# EasyEDA Pro project ProProject_new1_2024-06-04.epro

# Schematic New1_3
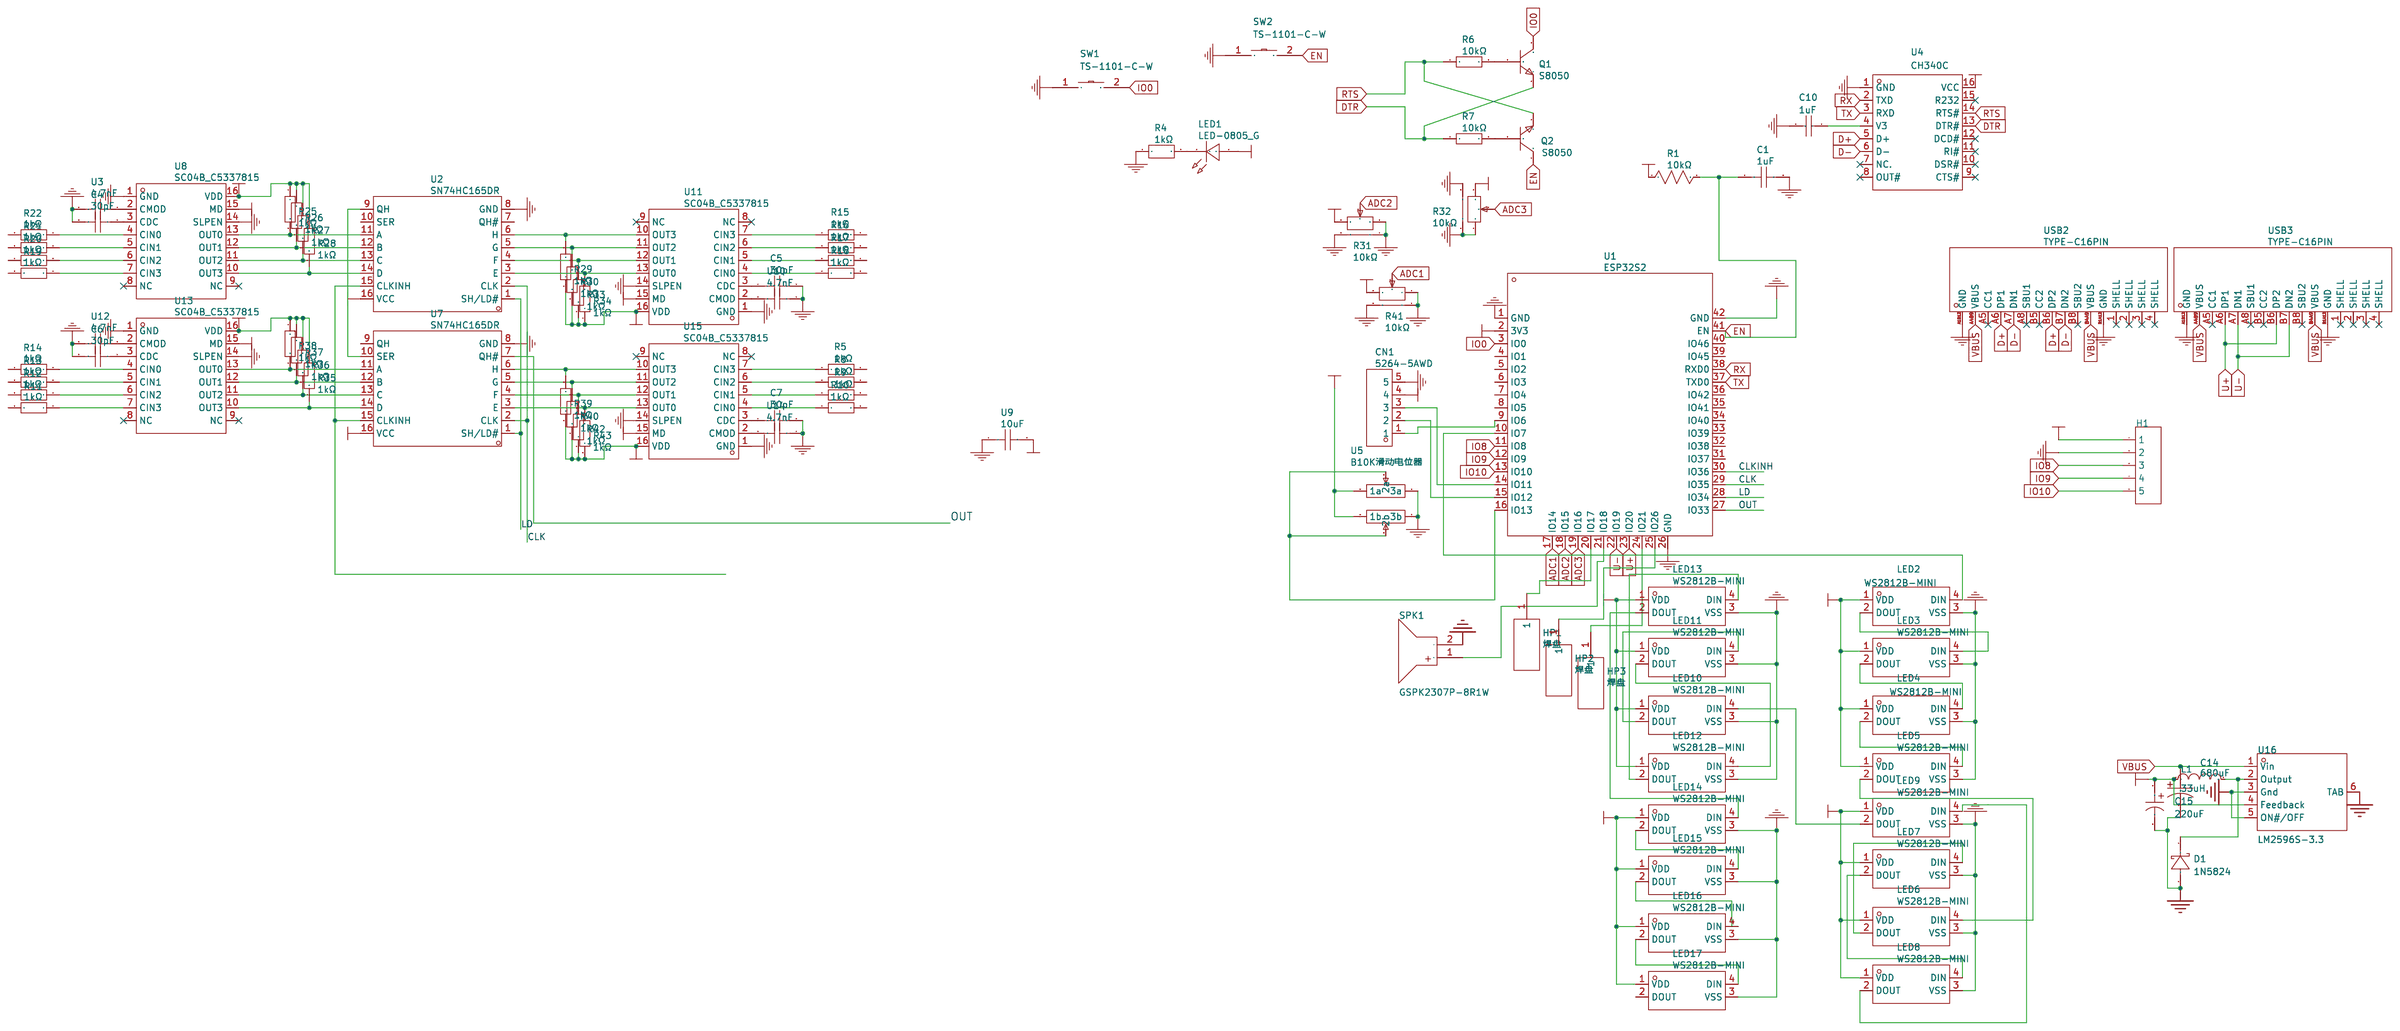
[diagram p0: schematic sheet]

## Parts
C1  1uF  [C0603]
C4  30pF  [C0603]
C5  30pF  [C0603]
C6  30pF  [C0603]
C7  30pF  [C0603]
C10  1uF  [C0805]
C14  680uF  [CAP-TH_BD6.3-P2.50-D1.0-FD]
C15  220uF  [CAP-TH_BD8.0-P3.50-D0.6-FD-2]
CN1  5264-5AWD  [CONN-TH_5P-P2.50_5264-5AWD]
D1  1N5824  [DO-27_BD5.3-L8.4-P12.40-D1.3-RD]
H1  -  [HDR-TH_5P-P2.54-V-F]
HP1  焊盘  [焊盘]
HP2  焊盘  [焊盘]
HP3  焊盘  [焊盘]
L1  33uH  [IND-SMD_L7.0-W6.6_FXL0630]
LED1  LED-0805_G  [LED0805_GREEN]
LED2  WS2812B-MINI  [LED-SMD_4P-L3.5-W3.5-TL_WS2812B]
LED3  WS2812B-MINI  [LED-SMD_4P-L3.5-W3.5-TL_WS2812B]
LED4  WS2812B-MINI  [LED-SMD_4P-L3.5-W3.5-TL_WS2812B]
LED5  WS2812B-MINI  [LED-SMD_4P-L3.5-W3.5-TL_WS2812B]
LED6  WS2812B-MINI  [LED-SMD_4P-L3.5-W3.5-TL_WS2812B]
LED7  WS2812B-MINI  [LED-SMD_4P-L3.5-W3.5-TL_WS2812B]
LED8  WS2812B-MINI  [LED-SMD_4P-L3.5-W3.5-TL_WS2812B]
LED9  WS2812B-MINI  [LED-SMD_4P-L3.5-W3.5-TL_WS2812B]
LED10  WS2812B-MINI  [LED-SMD_4P-L3.5-W3.5-TL_WS2812B]
LED11  WS2812B-MINI  [LED-SMD_4P-L3.5-W3.5-TL_WS2812B]
LED12  WS2812B-MINI  [LED-SMD_4P-L3.5-W3.5-TL_WS2812B]
LED13  WS2812B-MINI  [LED-SMD_4P-L3.5-W3.5-TL_WS2812B]
LED14  WS2812B-MINI  [LED-SMD_4P-L3.5-W3.5-TL_WS2812B]
LED15  WS2812B-MINI  [LED-SMD_4P-L3.5-W3.5-TL_WS2812B]
LED16  WS2812B-MINI  [LED-SMD_4P-L3.5-W3.5-TL_WS2812B]
LED17  WS2812B-MINI  [LED-SMD_4P-L3.5-W3.5-TL_WS2812B]
Q1  S8050  [SOT-23-3_L2.9-W1.3-P1.90-LS2.4-BR]
Q2  S8050  [SOT-23-3_L2.9-W1.3-P1.90-LS2.4-BR]
R1  10kΩ  [R0603]
R4  1kΩ  [R0805]
R5  1kΩ  [R0603]
R6  10kΩ  [R0805]
R7  10kΩ  [R0805]
R8  1kΩ  [R0603]
R9  1kΩ  [R0603]
R10  1kΩ  [R0603]
R11  1kΩ  [R0603]
R12  1kΩ  [R0603]
R13  1kΩ  [R0603]
R14  1kΩ  [R0603]
R15  1kΩ  [R0603]
R16  1kΩ  [R0603]
R17  1kΩ  [R0603]
R18  1kΩ  [R0603]
R19  1kΩ  [R0603]
R20  1kΩ  [R0603]
R21  1kΩ  [R0603]
R22  1kΩ  [R0603]
R25  1kΩ  [R0603]
R26  1kΩ  [R0603]
R27  1kΩ  [R0603]
R28  1kΩ  [R0603]
R29  1kΩ  [R0603]
R30  1kΩ  [R0603]
R31  10kΩ  [RES-ADJ-TH_RK09K1130AJ3]
R32  10kΩ  [RES-ADJ-TH_RK09K1130AJ3]
R33  1kΩ  [R0603]
R34  1kΩ  [R0603]
R35  1kΩ  [R0603]
R36  1kΩ  [R0603]
R37  1kΩ  [R0603]
R38  1kΩ  [R0603]
R39  1kΩ  [R0603]
R40  1kΩ  [R0603]
R41  10kΩ  [RES-ADJ-TH_RK09K1130AJ3]
R42  1kΩ  [R0603]
R43  1kΩ  [R0603]
SPK1  GSPK2307P-8R1W  [SPK-TH_BD23.0-P10.00-D0.8-L-RD]
SW1  TS-1101-C-W  [SW-SMD_L6.0-W3.3-LS8.0]
SW2  TS-1101-C-W  [SW-SMD_L6.0-W3.3-LS8.0]
U1  ESP32S2  [ESP32S2]
U2  SN74HC165DR  [SOP-16_L10.0-W3.9-P1.27-LS6.0-BL]
U3  4.7nF  [C0603]
U4  CH340C  [SOP-16_L10.0-W3.9-P1.27-LS6.0-BL]
U5  B10K滑动电位器  [B10K]
U7  SN74HC165DR  [SOP-16_L10.0-W3.9-P1.27-LS6.0-BL]
U8  SC04B_C5337815  [SOP-16_L10.0-W3.9-P1.27-LS6.0-BL]
U9  10uF  [C1206]
U10  4.7nF  [C0603]
U11  SC04B_C5337815  [SOP-16_L10.0-W3.9-P1.27-LS6.0-BL]
U12  4.7nF  [C0603]
U13  SC04B_C5337815  [SOP-16_L10.0-W3.9-P1.27-LS6.0-BL]
U14  4.7nF  [C0603]
U15  SC04B_C5337815  [SOP-16_L10.0-W3.9-P1.27-LS6.0-BL]
U16  LM2596S-3.3  [TO-263-5_L10.0-W8.4-P1.70-LS15.3-BR]
USB2  TYPE-C16PIN  [USB-C-SMD_TYPE-C16PIN]
USB3  TYPE-C16PIN  [USB-C-SMD_TYPE-C16PIN]

## Library data of the parts
C1 = CL10A105KB8NNNC: 容值:1uF;精度:±10%;额定电压:50V;材质(温度系数):X5R;; LCSC Part Name: 1uF ±10% 50V; Supplier Part: C15849; Manufacturer: SAMSUNG(三星); Supplier Footprint: 0603; JLCPCB Part Class: Basic Part; Datasheet: https://atta.szlcsc.com/upload/public/pdf/source/20160218/1457707763339.pdf; Supplier: LCSC; Tolerance: ±10%; Voltage Rated: 50V; Temperature Coefficient: X5R
C4-C7 = 30pF: Supplier: LCSC; Supplier Part: C376782; Manufacturer: CCTC(三环); Manufacturer Part: TCC0603COG300J500CT; JLCPCB Part Class: Extended Part
C10 = 1uF: Supplier: LCSC; Manufacturer: muRata(村田); Manufacturer Part: GRM21BR61E226ME44L; Supplier Part: C86816; JLCPCB Part Class: Extended Part
C14 = SHW680UF10V6.3X11: 容值:680uF;精度:±20%;额定电压:10V;纹波电流:980mA@100kHz;等效串联电阻:50mΩ@300kHz;; LCSC Part Name: 680uF ±20% 10V; Supplier Part: C494547; Manufacturer: KNSCHA(科尼盛); Supplier Footprint: 插件,D6.3xL11mm; JLCPCB Part Class: 扩展库; Datasheet: https://atta.szlcsc.com/upload/public/pdf/source/20200310/C494548_8AB2F4B606EB8D11D75E4665E4154421.pdf; Supplier: LCSC; Tolerance: ±20%; Rated Voltage: 10V; Ripple Current: 980mA@100kHz; Equivalent Series Resistance(ESR): 50mΩ@300kHz; Lead Spacing: 2.5mm; φD: 6.3mm; L: 11mm; Lifetime @ Temp: 10000hrs@105℃
C15 = KNH2220UF35V149EC0049: 容值:220uF;精度:±20%;额定电压:35V;纹波电流:1.7A@100kHz;等效串联电阻:40mΩ@100kHz;; LCSC Part Name: 220uF ±20% 35V; Supplier Part: C2981462; Manufacturer: KNSCHA(科尼盛); Supplier Footprint: 插件,D8xL9mm; JLCPCB Part Class: 扩展库; Datasheet: https://atta.szlcsc.com/upload/public/pdf/source/20220426/9FC8A158D93B909CC105160B4A0CB698.pdf; Supplier: LCSC; Tolerance: ±20%; Rated Voltage: 35V; Ripple Current: 1.7A@100kHz; Equivalent Series Resistance(ESR): 40mΩ@100kHz; Lead Spacing: 3.5mm; φD: 8mm; L: 9mm; Lifetime @ Temp: 2000hrs@105℃; Operating Temperature: -55℃~+105℃
CN1 = 5264-5AWD: Supplier: LCSC; Manufacturer: BOOMELE(博穆精密); Manufacturer Part: 5264-5AWD米色; Supplier Part: C176652; JLCPCB Part Class: Extended Part
D1 = 1N5824_C7503125: 二极管配置:独立式;正向压降(Vf):550mV@5A;直流反向耐压(Vr):30V;平均整流电流(Io):5A;; LCSC Part Name: 电压:30V 电流:5A; Supplier Part: C7503125; Manufacturer: FUXINSEMI(富芯森美); Supplier Footprint: DO-201AD; JLCPCB Part Class: 扩展库; Datasheet: https://atta.szlcsc.com/upload/public/pdf/source/20230904/20F3394C6D1B7A17743713246CA97DB3.pdf; Supplier: LCSC; Diode Configuration: 独立式; Forward Voltage (Vf@If): 550mV@5A; Reverse Voltage (Vr): 30V; Average Rectified Current (Io): 5A; Reverse Leakage Current (Ir): 500uA@30V; Peak forward surge current: 150A
H1 = HDR-F_2.54_1x5P: Supplier Part: C50950; Supplier Footprint: 插件
HP1-HP3 = 焊盘: Manufacturer: .....; Manufacturer Part: .....; Supplier Part: .....; link: .....; Check: false
L1 = FXL0630-330-M: 电感值:33uH;精度:±20%;额定电流:2A;饱和电流(Isat):2.5A;类型:一体成型电感;; LCSC Part Name: 33uH ±20% 2.5A; Supplier Part: C177245; Manufacturer: cjiang(长江微电); Supplier Footprint: SMD,6.6x7mm; JLCPCB Part Class: 扩展库; Datasheet: https://atta.szlcsc.com/upload/public/pdf/source/20230516/3A080F5AF8C87BB81C3BA86E5F60E51A.pdf; Supplier: LCSC; Tolerance: ±20%; Rated Current: 2A; Saturation Current (Isat): 2.5A; DC Resistance (DCR): 310mΩ; Type: 一体成型电感
LED1 = LED-0805_G: Manufacturer: 国星光电; Manufacturer Part: NCD0805G1; Supplier Part: C84260
LED2-LED17 = WS2812B-MINI: Supplier: LCSC; Supplier Part: C527089; Manufacturer: worldsemi; Manufacturer Part: WS2812B-MINI-V3/W; JLCPCB Part Class: Extended Part
Q1 Q2 = S8050: Supplier: LCSC; Manufacturer: Yenji; Supplier Part: C139514; JLCPCB Part Class: Extend
R1 = 0603WAF1002T5E: 电阻类型:厚膜电阻;阻值:10kΩ;精度:±1%;功率:100mW;最大工作电压:75V;温度系数:±100ppm/℃;; LCSC Part Name: 厚膜电阻 10kΩ ±1% 100mW; Supplier Part: C25804; Manufacturer: UNI-ROYAL(厚声); Supplier Footprint: 0603; JLCPCB Part Class: Basic Part; Datasheet: https://atta.szlcsc.com/upload/public/pdf/source/20200306/C422600_1E6D84923E4A46A82E41ADD87F860B5C.pdf; Supplier: LCSC; Type: 厚膜电阻; Tolerance: ±1%; Power(Watts): 100mW; Overload Voltage (Max): 75V; Temperature Coefficient: ±100ppm/℃; Operating Temperature Range: -55℃~+155℃
R4 = 1kΩ: Supplier: LCSC; Supplier Part: C2767302; Manufacturer: UNI-ROYAL(厚声); Manufacturer Part: 0805W8D1001T5E; JLCPCB Part Class: Extended Part
R5 R8-R22 R25-R30 R33-R40 R42 R43 = 1kΩ: Supplier: LCSC; Supplier Part: C336844; Manufacturer: PANASONIC(松下); Manufacturer Part: ERJ3RBD1001V; JLCPCB Part Class: Extended Part
R6 R7 = 10kΩ: Supplier: LCSC; Manufacturer: UNI-ROYAL(厚声); Manufacturer Part: 0805W8F1002T5E; Supplier Part: C17414; JLCPCB Part Class: Basic Part
R31 R32 R41 = 10kΩ: Supplier: LCSC; Supplier Part: C470295; Manufacturer: ALPSALPINE(阿尔卑斯阿尔派); Manufacturer Part: RK09K1130AP5; JLCPCB Part Class: Extended Part
SPK1 = GSPK2307P-8R1W: Supplier Part: C530531; Manufacturer: INGHAi(赢海); JLCPCB Part Class: 扩展库; Datasheet: https://atta.szlcsc.com/upload/public/pdf/source/20200723/C530531_BBB4236C037415C04A54E89A31B50803.pdf; Supplier: LCSC
SW1 SW2 = TS-1101-C-W: Supplier: LCSC; Supplier Part: C318938; Manufacturer: XKB Connectivity(中国星坤); JLCPCB Part Class: Extended Part
U1 = ESP32S2: Supplier: LCSC; Supplier Part: C2973654; Manufacturer: ESPRESSIF(乐鑫); Manufacturer Part: ESP32-S2-WROVER-I-N8R2
U2 U7 = SN74HC165DR: Supplier Part: C61060; Supplier: LCSC; Manufacturer: TI(德州仪器); JLCPCB Part Class: Extended Part
U3 U10 U12 U14 = 4.7nF: Supplier: LCSC; Supplier Part: C3894321; Manufacturer: TDK; Manufacturer Part: C1608JB2A472M080AA; JLCPCB Part Class: Extended Part
U4 = CH340C: Supplier Part: C84681; Supplier: LCSC; Manufacturer: WCH(南京沁恒); JLCPCB Part Class: Extended Part
U5 = B10K滑动电位器: Check: false
U8 U11 U13 U15 = SC04B_C5337815: Supplier Part: C5337815; Supplier: LCSC; Manufacturer: icman(晶尊微); Manufacturer Part: SC04B; JLCPCB Part Class: Extended Part
U9 = 10uF: Supplier: LCSC; Supplier Part: C2918487; Manufacturer: SAMWHA(三和); Manufacturer Part: CS3216Y5V106Z350NRI; JLCPCB Part Class: Extended Part
U16 = LM2596S-3.3: 功能类型:降压型;输出类型:固定;输入电压:40V;输出电压:3.3V;输出电流(最大值):3A;; Supplier Part: C347420; Manufacturer: UMW(友台半导体); Supplier Footprint: TO-263-5; JLCPCB Part Class: 扩展库; Datasheet: https://atta.szlcsc.com/upload/public/pdf/source/20230506/0930E65C3A8B7B120C8A4D8E5A8AC327.pdf; Supplier: LCSC; Function: 降压型; Output Type: 固定; Input Voltage: 40V; Output Voltage: 3.3V; Output Current (Max): 3A; Switching Frequency: 150kHz; Operating Temperature: -40℃~+125℃@(TA); Synchronous Rectification: 否; Number of Outputs: 1; Topology: 降压式; Switch tube (built-in/external): 内置
USB2 USB3 = TYPE-C16PIN: Supplier: LCSC; Supplier Part: C393939; Manufacturer: SHOU HAN(首韩); JLCPCB Part Class: Extended Part

## Nets
GND: C1.2 C4.2 C5.2 C6.2 C7.2 C10.2 C14.2 C15.2 CN1.5 D1.2(A) H1.2 LED2.3(VSS) LED3.3(VSS) LED4.3(VSS) LED5.3(VSS) LED6.3(VSS) LED7.3(VSS) LED8.3(VSS) LED9.3(VSS) LED10.3(VSS) LED11.3(VSS) LED12.3(VSS) LED13.3(VSS) LED14.3(VSS) LED15.3(VSS) LED16.3(VSS) LED17.3(VSS) R4.1 R31.1 R31.4 R31.5 R32.1 R32.4 R32.5 R41.1 R41.4 R41.5 SPK1.2(-) SW1.1 SW2.1 U1.1(GND) U1.26(GND) U1.42(GND) U2.8(GND) U3.1 U4.1(GND) U5.3a U5.3b U7.8(GND) U8.1(GND) U8.14(SLPEN) U9.1 U10.1 U11.1(GND) U11.14(SLPEN) U12.1 U13.1(GND) U13.14(SLPEN) U14.1 U15.1(GND) U15.14(SLPEN) U16.3(Gnd) U16.5(ON#/OFF) U16.6(TAB) USB2.A1B12(GND) USB2.B1A12(GND) USB3.A1B12(GND) USB3.B1A12(GND)
VBUS: C14.1 U16.1(Vin) USB2.A4B9(VBUS) USB2.B4A9(VBUS) USB3.A4B9(VBUS) USB3.B4A9(VBUS)
VCC: C15.1 CN1.4 H1.1 L1.1 LED1.1 LED2.1(VDD) LED3.1(VDD) LED4.1(VDD) LED5.1(VDD) LED6.1(VDD) LED7.1(VDD) LED8.1(VDD) LED9.1(VDD) LED10.1(VDD) LED11.1(VDD) LED12.1(VDD) LED13.1(VDD) LED14.1(VDD) LED15.1(VDD) LED16.1(VDD) LED17.1(VDD) R1.1 R25.1 R26.1 R27.1 R28.1 R29.1 R30.1 R31.3 R32.3 R33.1 R34.1 R35.1 R36.1 R37.1 R38.1 R39.1 R40.1 R41.3 R42.1 R43.1 U1.2(3V3) U2.16(VCC) U4.16(VCC) U5.1a U5.1b U7.16(VCC) U8.15(MD) U8.16(VDD) U9.2 U11.15(MD) U11.16(VDD) U13.15(MD) U13.16(VDD) U15.15(MD) U15.16(VDD) U16.4(Feedback)
ADC1: R41.2 U1.17(IO14)
ADC2: R31.2 U1.18(IO15)
ADC3: R32.2 U1.19(IO16)
CLK: U1.29(IO35) U2.2(CLK) U7.2(CLK)
CLKINH: U1.30(IO36)
D+: U4.5(D+) USB2.A6(DP1) USB2.B6(DP2)
D-: U4.6(D-) USB2.A7(DN1) USB2.B7(DN2)
DTR: Q1.2(E) R7.1 U4.13(DTR#)
EN: C1.1 Q2.3(C) R1.2 SW2.2 U1.41(EN)
IO0: Q1.3(C) SW1.2 U1.3(IO0)
IO8: H1.3 U1.11(IO8)
IO9: H1.4 U1.12(IO9)
IO10: H1.5 U1.13(IO10)
LD: U1.28(IO34) U2.1(SH/LD#) U7.1(SH/LD#)
OUT: U1.27(IO33) U7.7(QH#)
RTS: Q2.2(E) R6.1 U4.14(RTS#)
RX: U1.38(RXD0) U4.2(TXD)
TX: U1.37(TXD0) U4.3(RXD)
U+: U1.23(IO20) USB3.A6(DP1) USB3.B6(DP2)
U-: U1.22(IO19) USB3.A7(DN1) USB3.B7(DN2)
$1N3: C10.1 U4.4(V3)
$1N11: LED4.2(DOUT) LED5.4(DIN)
$1N12: LED2.2(DOUT) LED3.4(DIN)
$1N29: LED5.2(DOUT) LED6.4(DIN)
$1N30: LED7.2(DOUT) LED8.4(DIN)
$1N31: LED6.2(DOUT) LED7.4(DIN)
$1N32: LED8.2(DOUT) LED9.4(DIN)
$1N33: LED9.2(DOUT) LED10.4(DIN)
$1N34: LED10.2(DOUT) LED11.4(DIN)
$1N35: LED11.2(DOUT) LED12.4(DIN)
$1N36: LED12.2(DOUT) LED13.4(DIN)
$1N46: LED3.2(DOUT) LED4.4(DIN)
$1N47: LED2.4(DIN) U1.10(IO7)
$1N48: LED13.2(DOUT) LED14.4(DIN)
$1N49: LED14.2(DOUT) LED15.4(DIN)
$1N50: LED15.2(DOUT) LED16.4(DIN)
$1N51: LED16.2(DOUT) LED17.4(DIN)
$1N61: CN1.1 U1.9(IO6)
$1N66: R25.2 U2.11(A) U8.13(OUT0)
$1N67: R26.2 U2.12(B) U8.12(OUT1)
$1N68: R27.2 U2.13(C) U8.11(OUT2)
$1N69: R28.2 U2.14(D) U8.10(OUT3)
$1N71: R22.1 U8.4(CIN0)
$1N72: R21.1 U8.5(CIN1)
$1N73: R20.1 U8.6(CIN2)
$1N74: R19.1 U8.7(CIN3)
$1N75: R15.1 U11.7(CIN3)
$1N76: R16.1 U11.6(CIN2)
$1N77: R17.1 U11.5(CIN1)
$1N78: R18.1 U11.4(CIN0)
$1N79: R29.2 U2.6(H) U11.10(OUT3)
$1N81: R30.2 U2.5(G) U11.11(OUT2)
$1N82: R33.2 U2.4(F) U11.12(OUT1)
$1N85: R34.2 U2.3(E) U11.13(OUT0)
$1N90: R11.1 U13.7(CIN3)
$1N91: R12.1 U13.6(CIN2)
$1N92: R13.1 U13.5(CIN1)
$1N93: R14.1 U13.4(CIN0)
$1N94: R35.2 U7.14(D) U13.10(OUT3)
$1N96: R36.2 U7.13(C) U13.11(OUT2)
$1N97: R37.2 U7.12(B) U13.12(OUT1)
$1N100: R38.2 U7.11(A) U13.13(OUT0)
$1N102: R5.1 U15.7(CIN3)
$1N103: R8.1 U15.6(CIN2)
$1N104: R9.1 U15.5(CIN1)
$1N105: R10.1 U15.4(CIN0)
$1N106: R39.2 U7.6(H) U15.10(OUT3)
$1N108: R40.2 U7.5(G) U15.11(OUT2)
$1N109: R42.2 U7.4(F) U15.12(OUT1)
$1N112: R43.2 U7.3(E) U15.13(OUT0)
$1N114: U2.9(QH) U7.10(SER)
$1N2096: Q2.1(B) R7.2
$1N2099: Q1.1(B) R6.2
$1N2166: LED1.2 R4.2
$1N2213: C4.1 U8.3(CDC)
$1N2214: U3.2 U8.2(CMOD)
$1N2215: U10.2 U11.2(CMOD)
$1N2218: C5.1 U11.3(CDC)
$1N2223: U12.2 U13.2(CMOD)
$1N2226: C6.1 U13.3(CDC)
$1N2231: U14.2 U15.2(CMOD)
$1N2234: C7.1 U15.3(CDC)
$1N5140: D1.1(K) L1.2 U16.2(Output)
$1N5379: U2.15(CLKINH) U7.15(CLKINH)
$1N5430: CN1.3 U1.14(IO11)
$1N5439: CN1.2 U1.15(IO12)
$1N5456: U1.16(IO13) U5.2a U5.2b
$1N5500: HP1.1 U1.20(IO17)
$1N5779: HP3.1 U1.24(IO21)
$1N5793: HP2.1 U1.25(IO26)
$1N6036: SPK1.1(+) U1.21(IO18)

Not connected (* = marked no-connect by the designer): LED17 2(DOUT); R5 2; R8 2; R9 2; R10 2; R11 2; R12 2; R13 2; R14 2; R15 2; R16 2; R17 2; R18 2; R19 2; R20 2; R21 2; R22 2; U1 4(IO1) 5(IO2) 6(IO3) 7(IO4) 8(IO5) 31(IO37) 32(IO38) 33(IO39) 34(IO40) 35(IO41) 36(IO42) 39(IO45) 40(IO46); U2 7(QH#) 10(SER); U4 7(NC.)* 8(OUT#)* 9(CTS#)* 10(DSR#)* 11(RI#)* 12(DCD#)* 15(R232)*; U7 9(QH); U8 8(NC)* 9(NC)*; U11 8(NC)* 9(NC)*; U13 8(NC)* 9(NC)*; U15 8(NC)* 9(NC)*; USB2 1(SHELL)* 2(SHELL)* 3(SHELL)* 4(SHELL)* A5(CC1)* A8(SBU1)* B5(CC2)* B8(SBU2)*; USB3 1(SHELL)* 2(SHELL)* 3(SHELL)* 4(SHELL)* A5(CC1)* A8(SBU1)* B5(CC2)* B8(SBU2)*

# Board 1-PCB_PCB_New1_2
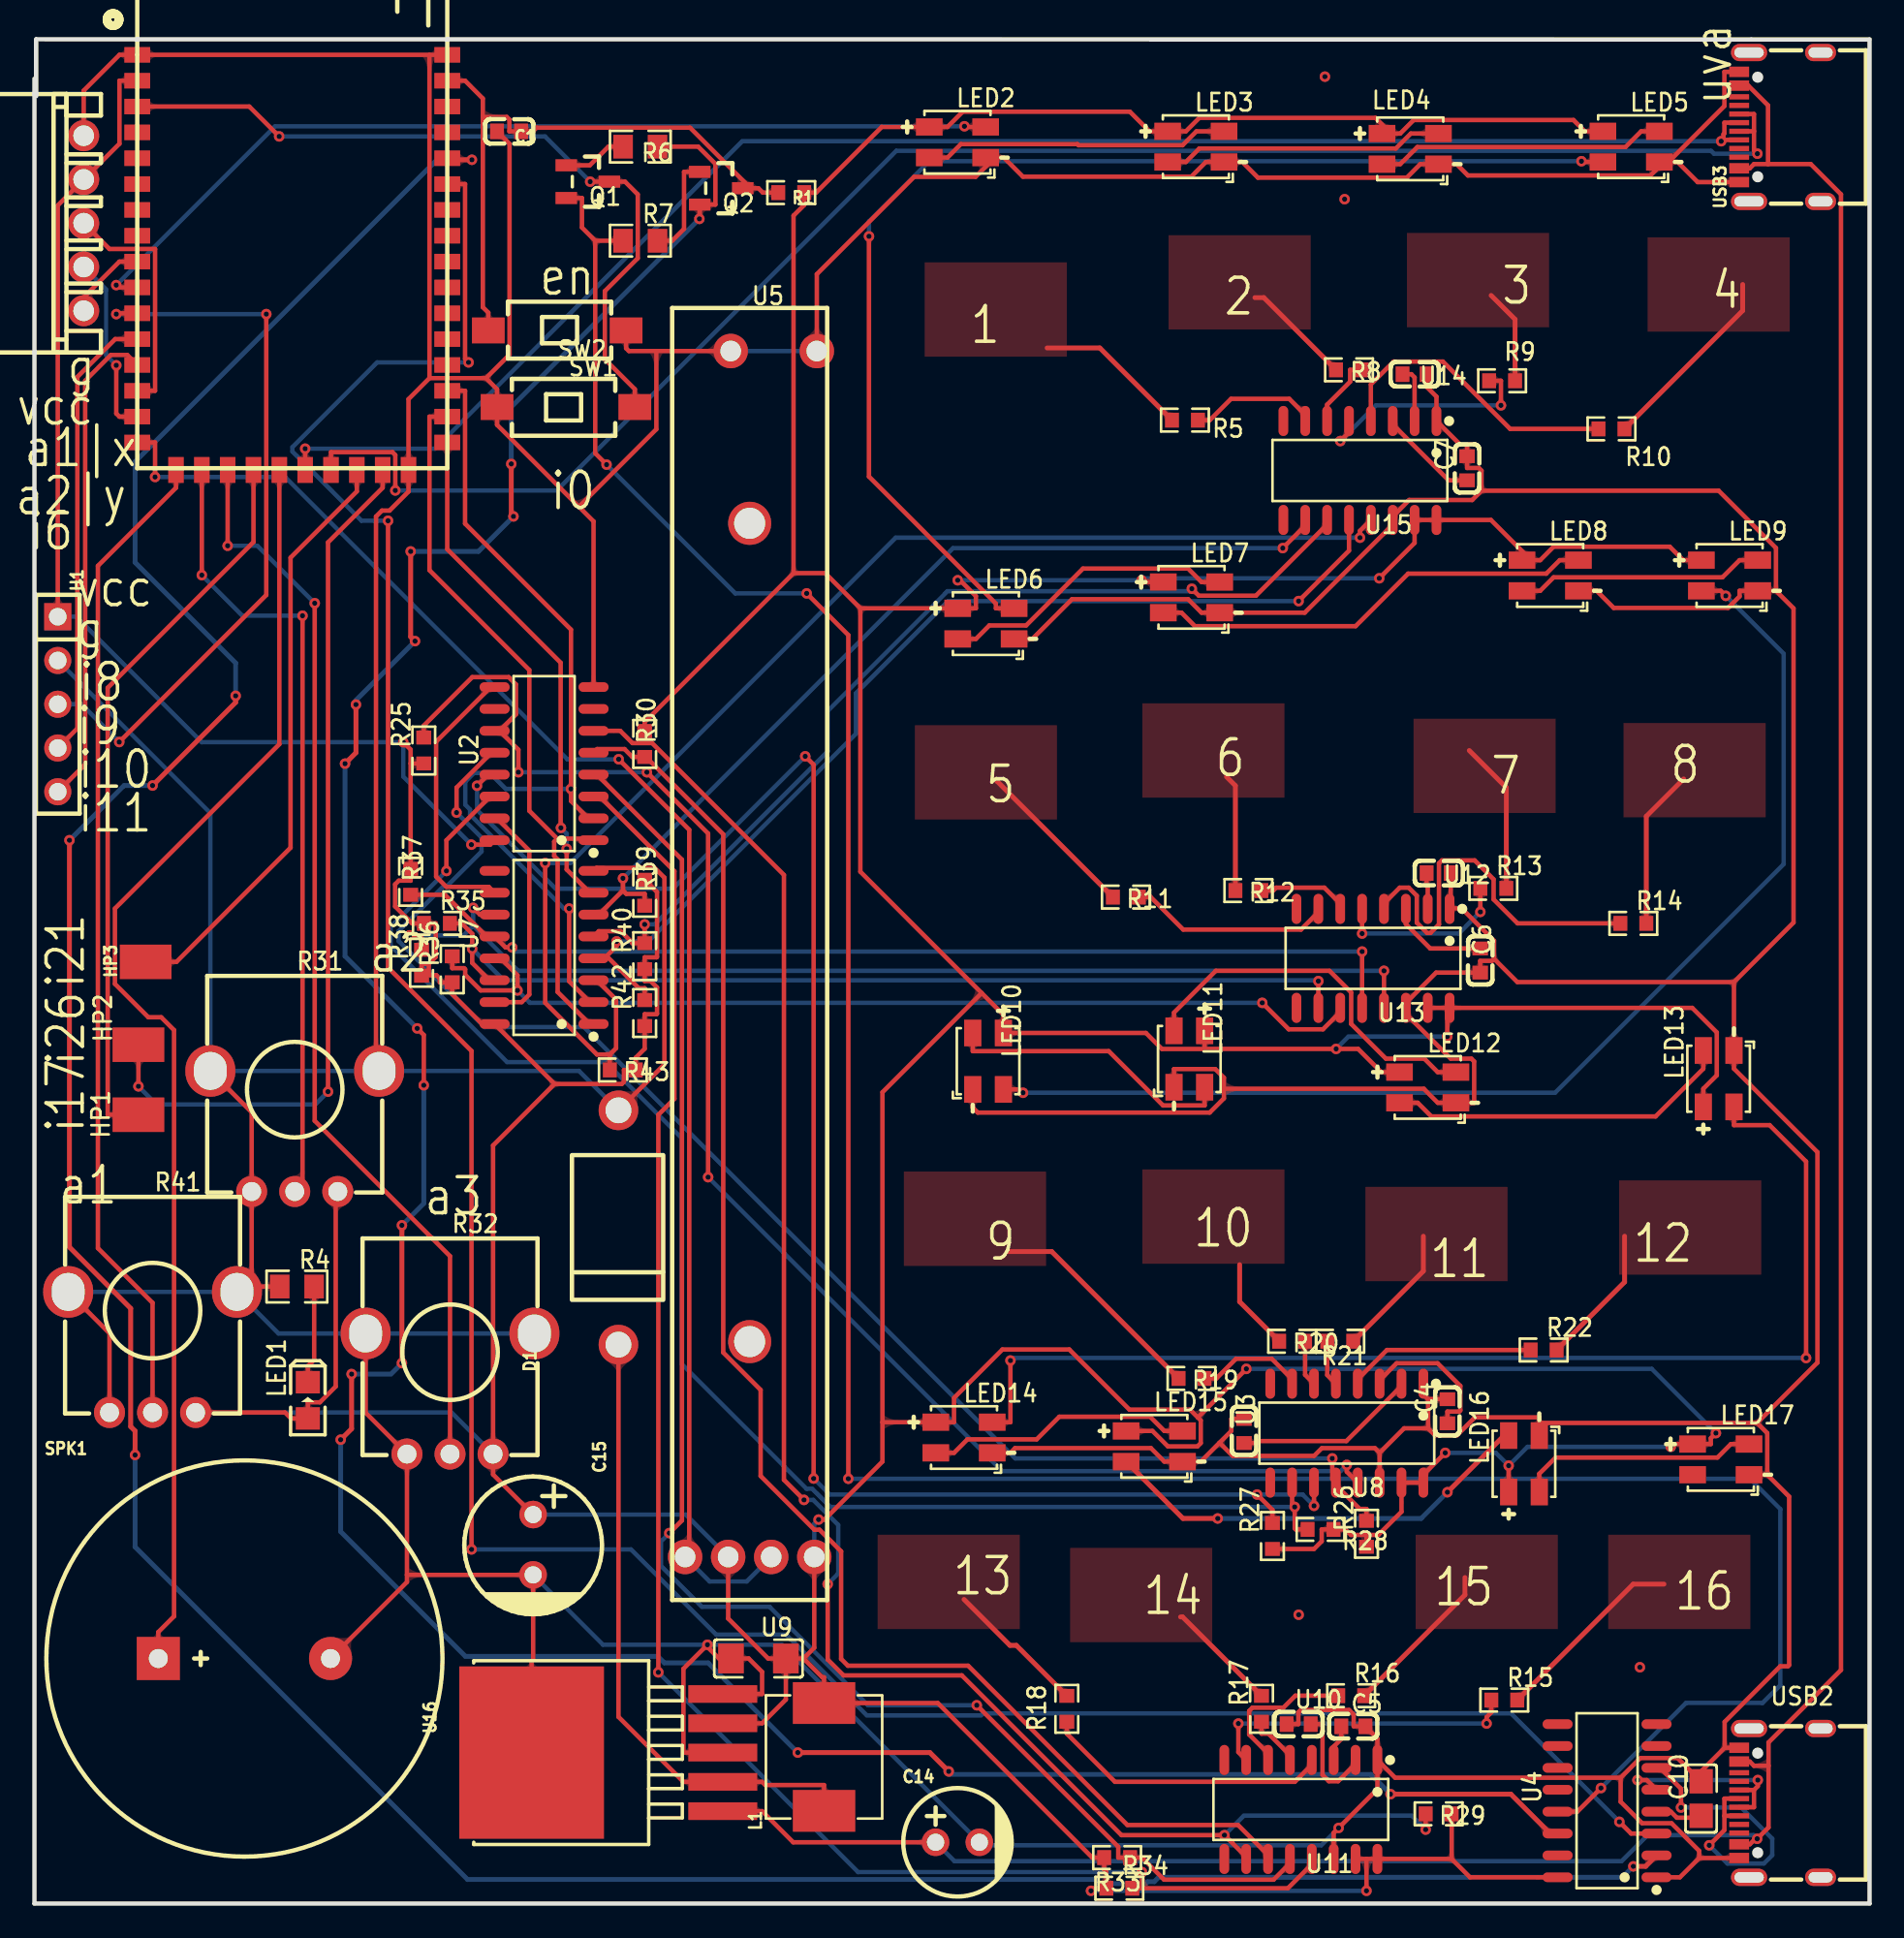
[diagram p1: board, top side]
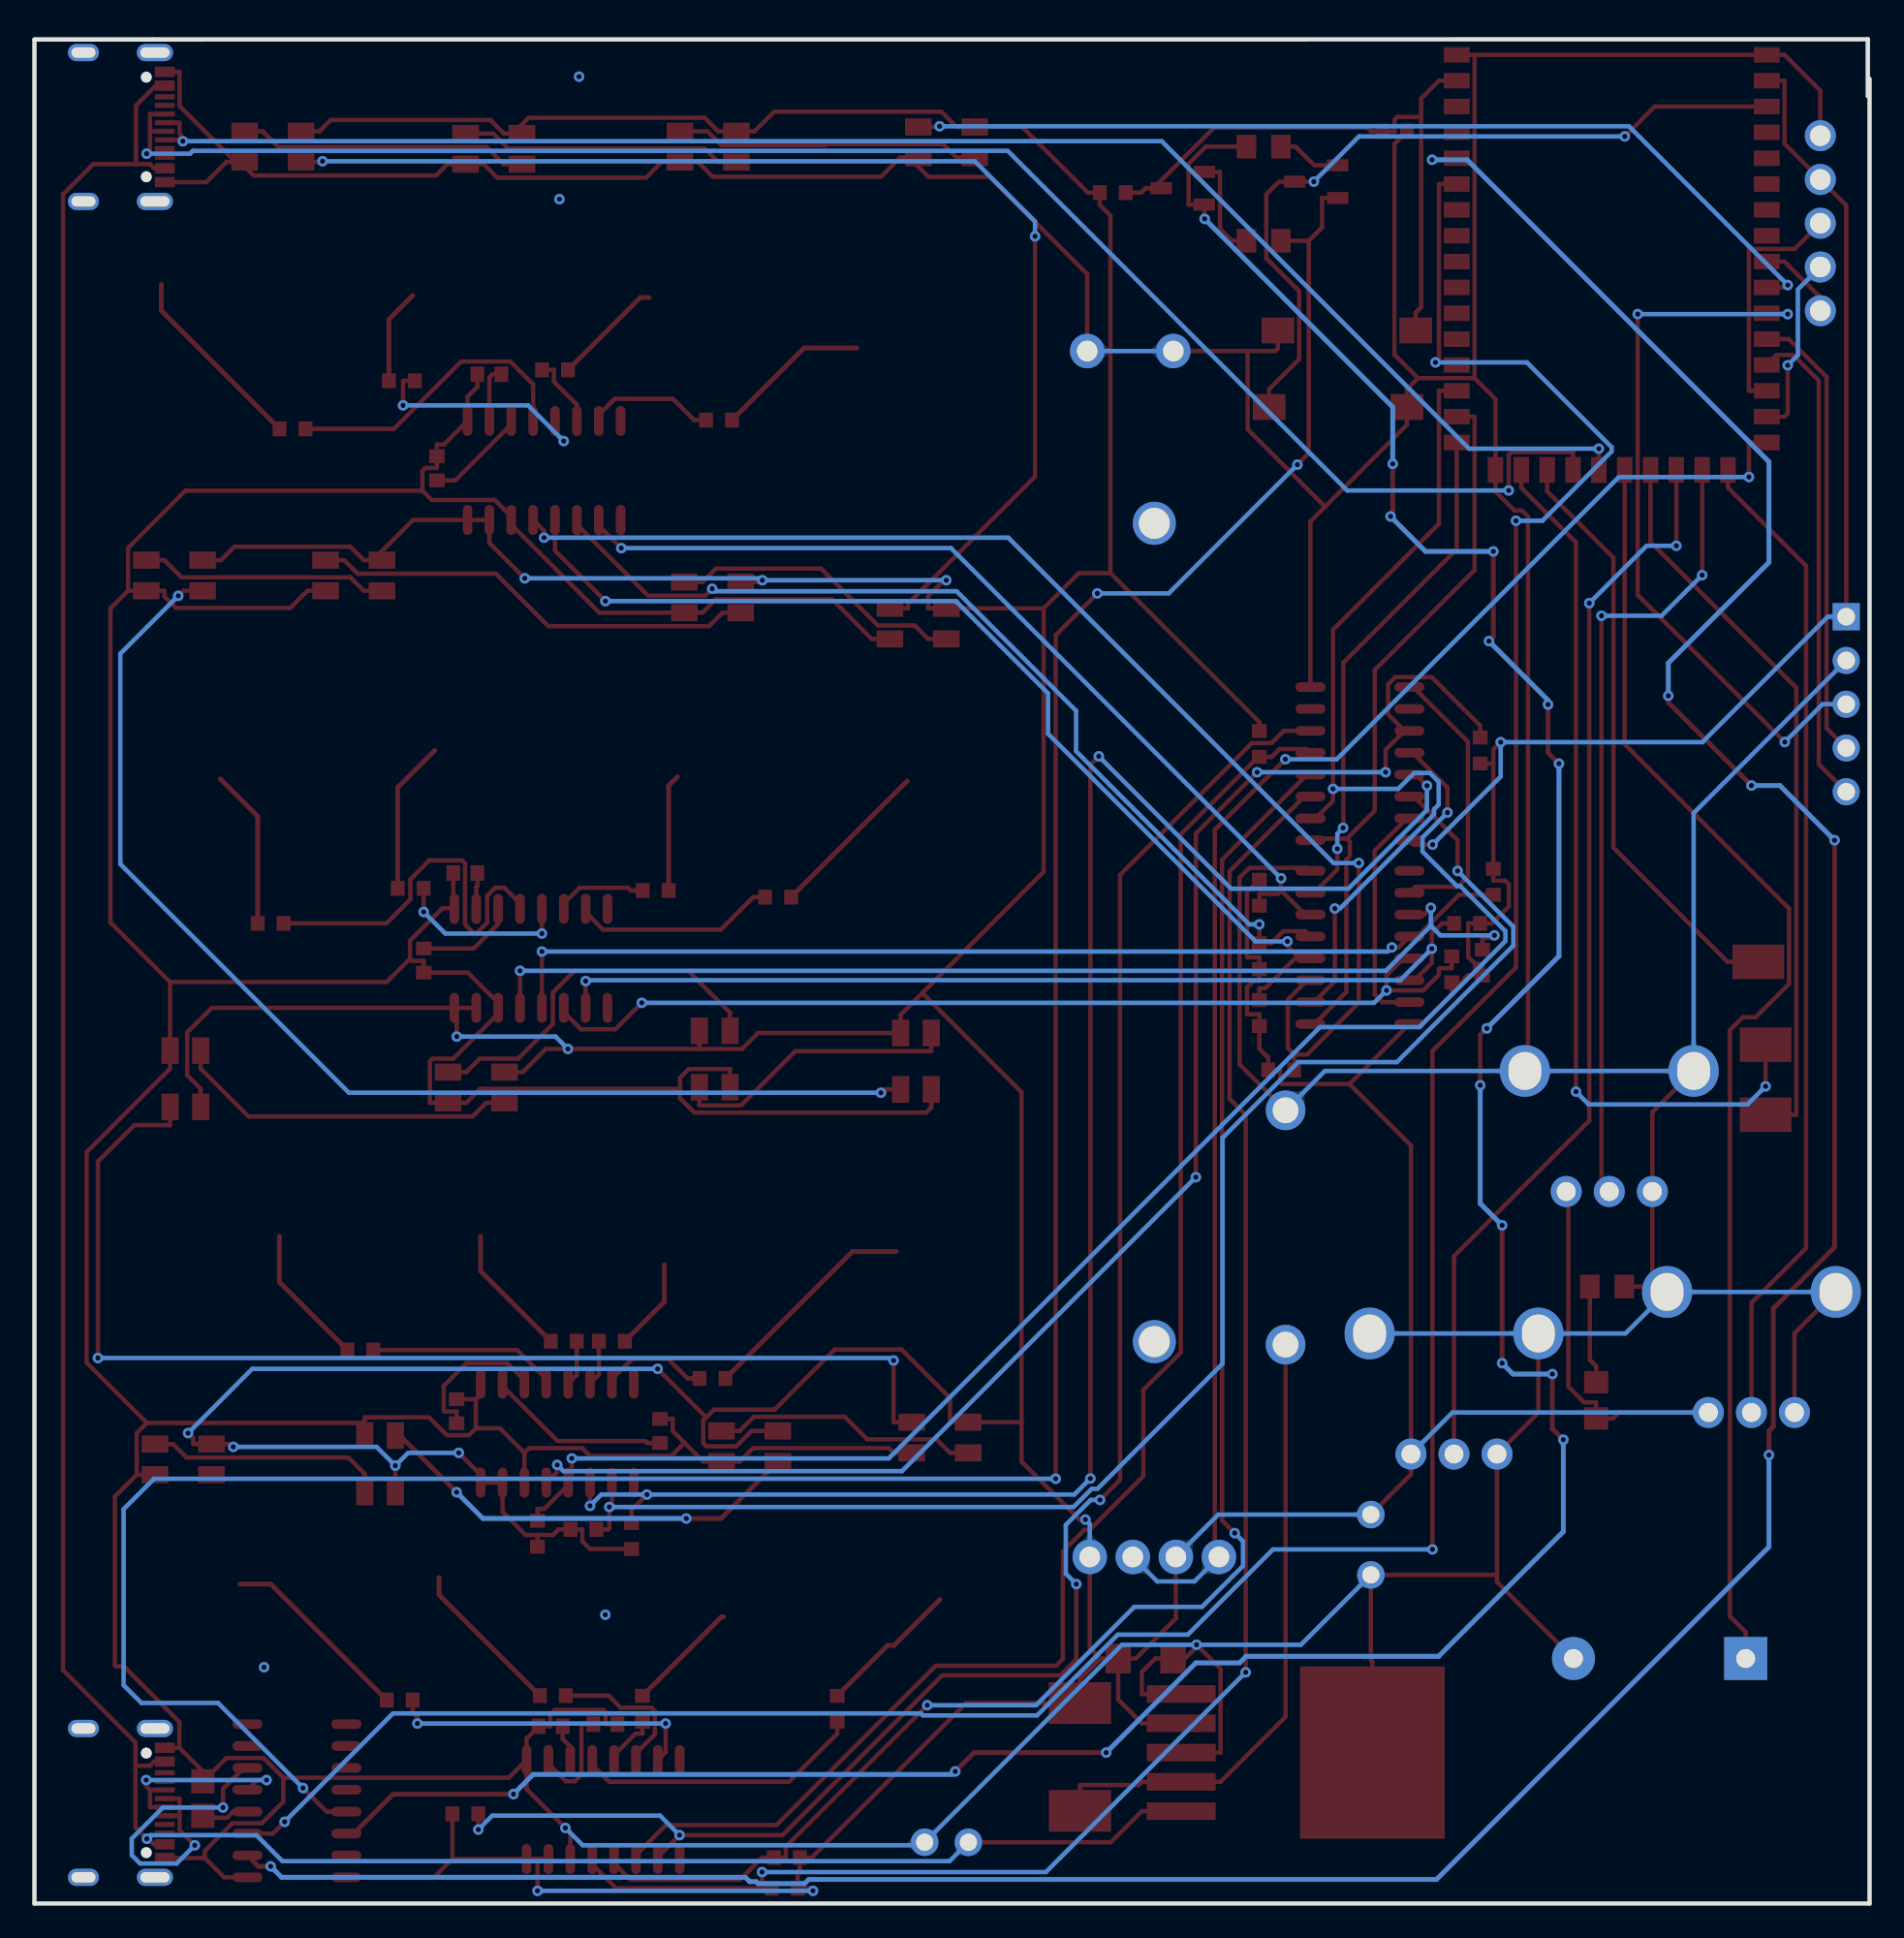
[diagram p2: board, bottom side, seen from below]

Outline 106.55 x 108.22 mm; copper layers: Top Layer, Bottom Layer. Coordinates in mm from the lower left corner of the outline.
Outline path: 0,105.92 0,0 106.55,0 106.55,108.2 99.67,108.2 0.1,108.22 0.1,104.91
Stack: Top Layer 0.035mm - / Dielectric1 1.51mm FR4 er 4.5 / Bottom Layer 0.035mm -

## Design rules (mm)
spacing Default (default): track to track 0.152, other pairs 0 to 0.152
track width Default (default): min 0.254, default 0.254, max 25.4
differential pair differentialPair (default): width min 0.127, default 0.254, max 2.54; gap min 0.152, default 0.152
via Default (default): diameter min 0.61, default 0.61, max 100.025; hole min 0.305, default 0.305, max 59.995
net GND uses gge1476470
pour e180 uses gge1476458

## Placement (name value [footprint] x y rotation side)
C1  1uF  [C0603]  27.56 102.87 180 top
C4  30pF  [C0603]  82.04 28.57 90 top
C5  30pF  [C0603]  76.58 10.29 0 top
C6  30pF  [C0603]  83.95 54.74 270 top
C7  30pF  [C0603]  83.19 83.31 90 top
C10  1uF  [C0805]  96.77 6.1 90 top
C14  680uF  [CAP-TH_BD6.3-P2.50-D1.0-FD]  53.59 3.56 0 top
C15  220uF  [CAP-TH_BD8.0-P3.50-D0.6-FD-2]  28.96 20.83 270 top
CN1  5264-5AWD  [CONN-TH_5P-P2.50_5264-5AWD]  2.16 97.54 90 top
D1  1N5824  [DO-27_BD5.3-L8.4-P12.40-D1.3-RD]  33.91 39.24 90 top
H1  -  [HDR-TH_5P-P2.54-V-F]  1.35 69.62 270 top
HP1  -  [焊盘]  6.04 45.79 90 top
HP2  -  [焊盘]  6.04 49.85 90 top
HP3  -  [焊盘]  6.46 54.66 90 top
L1  33uH  [IND-SMD_L7.0-W6.6_FXL0630]  45.85 8.51 90 top
LED1  LED-0805_G  [LED0805_GREEN]  15.88 29.21 90 top
LED2  WS2812B-MINI  [LED-SMD_4P-L3.5-W3.5-TL_WS2812B]  53.59 102.23 0 top
LED3  WS2812B-MINI  [LED-SMD_4P-L3.5-W3.5-TL_WS2812B]  67.44 101.98 0 top
LED4  WS2812B-MINI  [LED-SMD_4P-L3.5-W3.5-TL_WS2812B]  79.88 101.85 0 top
LED5  WS2812B-MINI  [LED-SMD_4P-L3.5-W3.5-TL_WS2812B]  92.71 101.98 0 top
LED6  WS2812B-MINI  [LED-SMD_4P-L3.5-W3.5-TL_WS2812B]  55.24 74.3 0 top
LED7  WS2812B-MINI  [LED-SMD_4P-L3.5-W3.5-TL_WS2812B]  67.18 75.82 0 top
LED8  WS2812B-MINI  [LED-SMD_4P-L3.5-W3.5-TL_WS2812B]  88.01 77.09 0 top
LED9  WS2812B-MINI  [LED-SMD_4P-L3.5-W3.5-TL_WS2812B]  98.42 77.09 0 top
LED10  WS2812B-MINI  [LED-SMD_4P-L3.5-W3.5-TL_WS2812B]  55.37 48.89 270 top
LED11  WS2812B-MINI  [LED-SMD_4P-L3.5-W3.5-TL_WS2812B]  67.06 49.02 270 top
LED12  WS2812B-MINI  [LED-SMD_4P-L3.5-W3.5-TL_WS2812B]  80.9 47.37 0 top
LED13  WS2812B-MINI  [LED-SMD_4P-L3.5-W3.5-TL_WS2812B]  97.79 47.88 90 top
LED14  WS2812B-MINI  [LED-SMD_4P-L3.5-W3.5-TL_WS2812B]  53.98 27.05 0 top
LED15  WS2812B-MINI  [LED-SMD_4P-L3.5-W3.5-TL_WS2812B]  65.02 26.54 0 top
LED16  WS2812B-MINI  [LED-SMD_4P-L3.5-W3.5-TL_WS2812B]  86.49 25.53 90 top
LED17  WS2812B-MINI  [LED-SMD_4P-L3.5-W3.5-TL_WS2812B]  97.92 25.78 0 top
Q1  S8050  [SOT-23-3_L2.9-W1.3-P1.90-LS2.4-BR]  32.13 99.95 180 top
Q2  S8050  [SOT-23-3_L2.9-W1.3-P1.90-LS2.4-BR]  39.88 99.57 180 top
R1  10kΩ  [R0603]  43.94 99.31 180 top
R4  1kΩ  [R0805]  15.24 35.81 0 top
R5  1kΩ  [R0603]  66.8 86.11 180 top
R6  10kΩ  [R0805]  35.18 101.98 180 top
R7  10kΩ  [R0805]  35.18 96.52 0 top
R8  1kΩ  [R0603]  76.33 89.03 180 top
R9  1kΩ  [R0603]  85.22 88.39 0 top
R10  1kΩ  [R0603]  91.57 85.6 0 top
R11  1kΩ  [R0603]  63.37 58.42 180 top
R12  1kΩ  [R0603]  70.48 58.8 180 top
R13  1kΩ  [R0603]  84.71 58.93 0 top
R14  1kΩ  [R0603]  92.84 56.9 0 top
R15  1kΩ  [R0603]  85.34 11.81 0 top
R16  1kΩ  [R0603]  76.45 12.06 0 top
R17  1kΩ  [R0603]  71.25 11.3 90 top
R18  1kΩ  [R0603]  59.94 11.3 90 top
R19  1kΩ  [R0603]  67.18 30.48 180 top
R20  1kΩ  [R0603]  73.02 32.64 180 top
R21  1kΩ  [R0603]  75.82 32.64 0 top
R22  1kΩ  [R0603]  87.63 32.13 0 top
R25  1kΩ  [R0603]  22.61 66.93 90 top
R26  1kΩ  [R0603]  77.34 21.46 90 top
R27  1kΩ  [R0603]  71.88 21.34 90 top
R28  1kΩ  [R0603]  74.68 21.72 180 top
R29  1kΩ  [R0603]  81.53 5.21 180 top
R30  1kΩ  [R0603]  35.43 67.31 270 top
R31  10kΩ  [RES-ADJ-TH_RK09K1130AJ3]  15.11 44.83 0 top
R32  10kΩ  [RES-ADJ-TH_RK09K1130AJ3]  24.13 29.59 0 top
R33  1kΩ  [R0603]  62.86 2.67 0 top
R34  1kΩ  [R0603]  62.99 0.89 0 top
R35  1kΩ  [R0603]  23.37 56.9 0 top
R36  1kΩ  [R0603]  24.26 54.23 90 top
R37  1kΩ  [R0603]  21.84 59.31 270 top
R38  1kΩ  [R0603]  22.48 54.61 90 top
R39  1kΩ  [R0603]  35.43 58.67 270 top
R40  1kΩ  [R0603]  35.43 54.99 90 top
R41  10kΩ  [RES-ADJ-TH_RK09K1130AJ3]  6.86 32 0 top
R42  1kΩ  [R0603]  35.43 51.69 90 top
R43  1kΩ  [R0603]  34.16 48.39 180 top
SPK1  GSPK2307P-8R1W  [SPK-TH_BD23.0-P10.00-D0.8-L-RD]  12.19 14.22 0 top
SW1  TS-1101-C-W  [SW-SMD_L6.0-W3.3-LS8.0]  30.86 86.87 0 top
SW2  TS-1101-C-W  [SW-SMD_L6.0-W3.3-LS8.0]  30.35 91.31 180 top
U1  -  [ESP32S2]  5.97 107.31 0 top
U2  SN74HC165DR  [SOP-16_L10.0-W3.9-P1.27-LS6.0-BL]  29.59 66.17 90 top
U3  4.7nF  [C0603]  70.23 27.43 270 top
U4  CH340C  [SOP-16_L10.0-W3.9-P1.27-LS6.0-BL]  91.31 5.97 90 top
U5  B10K滑动电位器  [B10K]  41.53 55.12 0 top
U7  SN74HC165DR  [SOP-16_L10.0-W3.9-P1.27-LS6.0-BL]  29.59 55.5 90 top
U8  SC04B_C5337815  [SOP-16_L10.0-W3.9-P1.27-LS6.0-BL]  76.2 27.31 180 top
U9  10uF  [C1206]  42.04 14.22 0 top
U10  4.7nF  [C0603]  73.41 10.41 0 top
U11  SC04B_C5337815  [SOP-16_L10.0-W3.9-P1.27-LS6.0-BL]  73.53 5.46 180 top
U12  4.7nF  [C0603]  81.53 59.82 180 top
U13  SC04B_C5337815  [SOP-16_L10.0-W3.9-P1.27-LS6.0-BL]  77.72 54.86 180 top
U14  4.7nF  [C0603]  80.14 88.77 180 top
U15  SC04B_C5337815  [SOP-16_L10.0-W3.9-P1.27-LS6.0-BL]  76.96 83.19 180 top
U16  LM2596S-3.3  [TO-263-5_L10.0-W8.4-P1.70-LS15.3-BR]  34.42 8.76 0 top
USB2  TYPE-C16PIN  [USB-C-SMD_TYPE-C16PIN]  101.35 5.84 90 top
USB3  TYPE-C16PIN  [USB-C-SMD_TYPE-C16PIN]  101.35 103.12 90 top

## Footprints (pads in the part's own frame, mm; a bottom-side part is the same pattern mirrored in y, then rotated)
B10K
  round 2 hole 1.2: 1a(-1.25,-35) 1b(3.75,-35) 2a(-3.75,-35) 2b(1.25,-35) 3a(-1.101,35) 3b(3.898,35)
  round 2.5 hole 1.8: 9(0,25) 10(0,-22.5)
C0603
  rect 0.8x0.9 smd: 1(-0.7,0) 2(0.7,0)
C0805
  rect 1.41x1.35 smd: 1(-1,0) 2(1,0)
C1206
  rect 1.485x1.728 smd: 1(-1.593,0) 2(1.593,0)
CAP-TH_BD6.3-P2.50-D1.0-FD
  round 1.6 hole 1: 1(-1.27,0) 2(1.27,0)
CAP-TH_BD8.0-P3.50-D0.6-FD-2
  round 1.6 hole 1: 1(-1.75,0) 2(1.75,0)
CONN-TH_5P-P2.50_5264-5AWD
  round 1.8 hole 1.2: 1(-5.08,-0.7) 2(-2.54,-0.7) 3(0,-0.7) 4(2.54,-0.7) 5(5.08,-0.7)
DO-27_BD5.3-L8.4-P12.40-D1.3-RD
  round 2.3 hole 1.5: 1(-6.8,0) 2(6.8,0)
ESP32S2
  rect 1.5x0.9 smd: 1(0,-0.005) 2(0,-1.506) 3(0,-3.006) 4(0,-4.505) 5(0,-6.005) 6(0,-7.505) 7(0,-9.005) 8(0,-10.505) 9(0,-12.005) 10(0,-13.505) 11(0,-15.005) 12(0,-16.506) 13(0,-18.006) 14(0,-19.506) 15(0,-21.006) 16(0,-22.506) 27(18,-22.506) 28(18,-21.006) 29(18,-19.506) 30(18,-18.006) 31(18,-16.506) 32(18,-15.005) 33(18,-13.505) 34(18,-12.005) 35(18,-10.505) 36(18,-9.005) 37(18,-7.505) 38(18,-6.005) 39(18,-4.505) 40(18,-3.006) 41(18,-1.506) 42(18,-0.005)
  rect 0.9x1.5 smd: 17(2.25,-24.1) 18(3.75,-24.1) 19(5.25,-24.1) 20(6.75,-24.1) 21(8.25,-24.1) 22(9.75,-24.1) 23(11.25,-24.1) 24(12.75,-24.1) 25(14.25,-24.1) 26(15.75,-24.1)
HDR-TH_5P-P2.54-V-F
  rect 1.575x1.575 hole 1.02: 1(-5.08,0)
  round 1.575 hole 1.02: 2(-2.54,0) 3(0,0) 4(2.54,0) 5(5.08,0)
IND-SMD_L7.0-W6.6_FXL0630
  rect 2.424x3.62 smd: 1(3.128,0) 2(-3.128,0)
LED0805_GREEN
  rect 1.3x1.399 smd: 1(-1.05,0) 2(1.05,0)
LED-SMD_4P-L3.5-W3.5-TL_WS2812B
  rect 1.545x0.997 smd: 1(-1.637,0.89) 2(-1.637,-0.89) 3(1.637,-0.89) 4(1.637,0.89)
R0603
  rect 0.806x0.864 smd: 1(-0.753,0) 2(0.753,0)
R0805
  rect 1.133x1.377 smd: 1(-1,0) 2(1,0)
RES-ADJ-TH_RK09K1130AJ3
  round 1.8 hole 1.1: 1(-2.5,-3.5) 2(0,-3.5) 3(2.5,-3.5)
  oval 2.9x3 hole 1.9x2.2: 4(-4.9,3.5) 5(4.9,3.5)
SOP-16_L10.0-W3.9-P1.27-LS6.0-BL
  oval 0.56x1.745 smd: 1(-4.445,-2.873) 2(-3.175,-2.873) 3(-1.905,-2.873) 4(-0.635,-2.873) 5(0.635,-2.873) 6(1.905,-2.873) 7(3.175,-2.873) 8(4.445,-2.873) 9(4.445,2.873) 10(3.175,2.873) 11(1.905,2.873) 12(0.635,2.873) 13(-0.635,2.873) 14(-1.905,2.873) 15(-3.175,2.873) 16(-4.445,2.873)
SOT-23-3_L2.9-W1.3-P1.90-LS2.4-BR
  rect 1.25x0.7 smd: 1(1.25,-0.95) 2(1.25,0.95) 3(-1.25,0)
SPK-TH_BD23.0-P10.00-D0.8-L-RD
  rect 2.5x2.5 hole 1.1: 1(-5,0)
  round 2.5 hole 1.1: 2(5,0)
SW-SMD_L6.0-W3.3-LS8.0
  rect 1.9x1.5 smd: 1(-4,0) 2(4,0)
TO-263-5_L10.0-W8.4-P1.70-LS15.3-BR
  rect 4x1.02 smd: 1(5.55,-3.4) 2(5.55,-1.7) 3(5.55,0) 4(5.55,1.7) 5(5.55,3.4)
  rect 8.4x10 smd: 6(-5.55,0)
USB-C-SMD_TYPE-C16PIN
  oval 1x2.1 hole 0.6x1.7: 1(-4.32,1.788) 2(4.32,1.788)
  oval 1x1.8 hole 0.6x1.4: 3(-4.32,-2.362) 4(4.32,-2.362)
  rect 0.6x1.15 smd: A1B12(-3.2,2.362) A4B9(-2.4,2.362) B1A12(3.2,2.362) B4A9(2.4,2.362)
  rect 0.3x1.15 smd: A5(-1.25,2.362) A6(-0.25,2.362) A7(0.25,2.362) A8(-1.75,2.362) B5(1.75,2.362) B6(0.75,2.362) B7(-0.75,2.362) B8(1.25,2.362)
焊盘
  rect 2x3 smd: 1(0,0)

## Nets
As in the schematic.

Pads without a net: LED17 2; R5 2; R8 2; R9 2; R10 2; R11 2; R12 2; R13 2; R14 2; R15 2; R16 2; R17 2; R18 2; R19 2; R20 2; R21 2; R22 2; U1 4 5 6 7 8 31 32 33 34 35 36 39 40; U2 7 10; U4 7 8 9 10 11 12 15; U5 9 10; U7 9; U8 8 9; U11 8 9; U13 8 9; U15 8 9; USB2 1 2 3 4 A5 A8 B5 B8; USB3 1 2 3 4 A5 A8 B5 B8

## Via types
v1: diameter 0.61, hole 0.305, Top Layer to Bottom Layer, 132 vias

## Routing (per net, layer and track width the routed paths; a pad name or vN(x,y) marks a point on that pad's centre or on a via; arc(x,y) is an arc through that point)
GND: length 781.4
  Top Layer w0.254: 98.68,53.49 102.14,56.94 102.14,75.18 101.12,76.2 ; 98.68,53.49 98.68,48.46 103.53,43.61 103.53,31.4 100.02,27.9 ; 98.68,53.49 86.1,53.49 84.75,54.84 ; 1.96,35.5 4.36,33.1 4.36,28.5 ; U14.1 80.84,88.04 81.41,87.47 U15.1 82.77,84.7 83.19,84.7 83.19,83.33 83.87,83.33 84.02,83.17 84.02,82.01 ; 21.63,19.08 C15.2 28.96,14.14 28.87,14.05 U16.6 ; 21.63,19.08 21.63,18.66 17.19,14.22 ; 21.63,19.08 21.63,26.09 19.23,28.49 19.23,33.09 ; 22.94,107.31 U1.1 4.94,107.31 2.86,105.23 2.86,102.62 ; 22.94,107.31 U1.42 ; 22.94,107.31 22.94,88.54 ; 69.07,47.3 69.07,46.74 68.24,45.91 54.77,45.91 54.48,46.2 54.48,47.26 ; 69.07,47.3 80.67,47.3 81.48,46.48 LED12.3 83.59,46.48 83.59,48.88 83.43,49.04 82.23,49.04 79.63,51.65 U13.14 79.63,52.28 81.38,54.04 C6.2 83.95,54.72 84.63,54.72 84.75,54.84 ; 69.07,47.3 69.07,47.94 68.56,48.44 66.17,48.44 66.17,48.44 66.17,47.38 ; 89.65,76.2 90.71,76.2 91.7,75.21 98.34,75.21 99.01,75.88 99.01,76.2 101.12,76.2 ; 68.81,26.75 69.5,27.43 69.5,28.13 70.23,28.13 ; 68.81,26.75 67.72,25.65 65.61,25.65 64.83,26.44 56.94,26.44 56.67,26.16 LED14.3 ; 68.81,26.75 69.57,25.98 74.3,25.98 74.75,26.43 77.83,26.43 78.11,26.16 ; 98.98,9.04 98.14,9.04 ; 98.14,9.04 98.14,10.55 101.37,13.77 101.81,13.77 101.88,13.85 101.88,23.62 100.61,24.89 ; 98.14,9.04 96.48,7.39 ; 36.11,90.12 34.51,90.12 34.35,90.28 SW2.1 ; 36.11,90.12 U5.3a ; 36.11,90.12 36.11,85.58 31.61,81.08 ; 31.61,81.08 32.46,80.23 U2.8 ; 31.61,81.08 26.86,85.83 SW1.1 26.86,87.9 26.22,88.54 ; 55.76,101.35 56.29,101.35 57.39,100.24 67.17,100.24 68.02,101.09 70.13,101.09 71.04,100.18 79.69,100.18 80.46,100.97 82.58,100.97 83.23,100.31 93.83,100.31 94.61,101.09 ; 55.76,101.35 54.64,100.23 51.07,100.23 45.43,94.58 45.43,90.12 ; 55.76,101.35 55.23,101.35 ; 98.98,99.92 96.57,99.92 95.41,101.09 94.88,101.09 ; 80.92,27.58 81.32,27.19 82.6,27.19 83.64,28.22 87.38,28.22 87.38,27.74 ; 80.92,27.58 80.92,29.28 ; 80.92,27.58 79.53,27.58 78.11,26.16 ; U11.1 79.01,7.3 92.1,7.3 ; U11.1 77.98,6.64 v1(75.73,4.39) 75.44,4.1 U11.14 ; U11.1 77.98,9.58 77.27,10.29 ; 94.61,101.09 94.88,101.09 ; 94.61,101.09 94.35,101.09 ; 94.88,101.09 98.13,104.34 98.13,106.32 98.98,106.32 ; 92.1,7.3 92.1,5.91 93.35,4.66 95.06,4.66 96.66,3.06 96.66,2.64 ; 92.1,7.3 93.24,8.45 95.41,8.45 96.46,7.39 96.48,7.39 ; 77.27,10.29 76.6,10.29 76.6,10.97 76.34,11.23 73.52,11.23 73.39,11.1 73.39,10.41 U10.1 ; 77.27,10.29 C5.2 ; U8.1 80.64,29.55 80.92,29.28 ; 39.97,12.16 42.25,12.16 42.25,13.44 41.47,14.22 U9.1 39.75,14.22 39.08,14.89 v1(39.08,15.02) 37.68,13.63 37.68,8.76 U16.3 ; 96.66,2.64 98.98,2.64 ; 96.66,2.64 95.54,1.52 U4.1 ; R31.5 19.83,48.51 19.83,80.51 20.18,80.86 20.62,80.86 21.72,81.96 21.72,87.33 22.94,88.54 ; 96.48,7.39 96.77,7.1 ; 78.11,26.16 U8.14 ; 87.38,27.17 87.38,27.74 ; 87.38,27.74 87.53,27.9 100.02,27.9 ; 84.75,54.84 84.75,55.89 82.87,57.77 82.23,57.77 ; U13.1 82.2,57.77 82.23,57.77 ; 80.92,29.28 82.04,29.28 ; 101.12,76.2 101.12,78.68 97.79,82.01 84.02,82.01 ; 22.94,88.54 26.22,88.54 ; 100.61,24.89 100.61,27.31 100.02,27.9 ; 100.61,24.89 LED17.3 ; 12.61,35.81 R31.1 12.61,45.93 R31.4 ; 12.61,35.81 12.3,35.5 R41.5 ; 12.61,35.81 14.24,35.81 ; 82.23,57.77 82.23,59.82 ; 84.02,82.01 83.48,81.47 79.82,81.47 78.87,80.51 U15.14 78.87,80.04 73.76,74.93 LED7.3 67.76,74.93 66.98,75.71 60.24,75.71 57.94,73.41 LED6.3 ; D1.2 36.58,48.71 36.58,59.55 36.01,60.12 32.64,60.12 U7.8 ; 26.22,88.54 27.59,89.91 27.59,102.14 26.86,102.87
  Bottom Layer w0.254: 1.96,35.5 R41.5 14.17,33.09 29.03,33.09 ; v1(75.73,4.39) 74.72,3.38 55.04,3.38 C14.2 43.4,15.02 v1(39.08,15.02) 33.01,15.02 C15.2 ; 1.35,72.16 10.21,63.3 R31.4 R31.5 31.62,48.33 D1.2 ; U5.3a 45.43,90.12
  vias: v1(73.41,16.76) v1(74.93,106.05) v1(76.07,98.93) v1(93.22,13.72)
VBUS: length 174.7
  Top Layer w0.254: 100.66,100.97 103.14,100.97 104.89,99.21 104.89,13.56 100.69,9.35 100.69,8 ; 100.66,100.97 99.84,100.97 99.6,100.72 98.98,100.72 ; 100.66,100.97 100.66,104.38 99.51,105.52 98.98,105.52 ; 100.69,8 99.84,8 99.6,8.24 98.98,8.24 ; 100.69,8 100.69,4.42 v1(100.03,3.76) 99.92,3.76 99.6,3.44 98.98,3.44 ; U16.1 42.25,5.36 44.06,3.56 C14.1
  Bottom Layer w0.254: C14.1 53.42,2.46 92.15,2.46 93.67,3.97 99.82,3.97 v1(100.03,3.76)
VCC: length 636.4
  Top Layer w0.254: 91.07,102.87 90.02,102.87 89.36,103.53 80.08,103.53 79.3,102.74 78.77,102.74 ; v1(53.61,76.81) 53.74,76.81 54.66,75.89 54.66,75.18 47.95,75.18 ; U9.2 43.63,11.84 42.25,10.46 U16.4 ; U9.2 42.6,14.22 40.28,16.55 U5.1a ; U9.2 44.66,14.22 ; 77.34,21.4 78.03,21.4 79.38,22.74 U8.15 U8.16 80.64,24.89 v1(81.92,26.16) ; 77.34,21.4 76.44,21.4 76.12,21.72 74.74,21.72 74.74,21.03 74.3,20.58 R27.1 ; 77.34,21.4 77.34,20.71 ; 67.55,28.22 67.72,28.05 67.72,26.73 67.53,26.54 65.81,26.54 64.92,27.43 63.39,27.43 ; 67.55,28.22 67.1,28.67 63.58,28.67 60.09,32.16 56.2,32.16 53.39,29.35 53.39,27.94 LED14.1 49.24,27.94 ; 67.55,28.22 v1(70.37,31.04) ; 30.2,47.57 U7.16 25.99,51.05 24.26,52.79 24.26,53.47 23.54,53.47 23.54,53.68 23.34,53.89 22.97,53.89 22.9,53.96 22.9,54.54 ; 30.2,47.57 34.1,47.57 34.23,47.7 34.23,48.39 R43.1 34.92,49.1 35.43,49.62 35.43,51.62 36.12,51.62 36.15,51.65 36.15,53.18 35.78,53.55 35.43,53.55 35.43,54.92 36.12,54.92 36.15,54.95 36.15,58.71 R39.1 ; 30.2,47.57 26.63,44.01 R32.3 26.63,24.9 C15.1 ; 78.24,102.74 78.77,102.74 ; 78.77,102.74 77.86,103.65 67.64,103.65 66.86,102.87 LED3.1 64.74,102.87 63.6,104.01 53.9,104.01 53.01,103.12 49.19,103.12 45.38,99.31 44.7,99.31 44.7,98.6 44.08,97.98 44.08,77.23 ; 47.95,75.18 45.91,77.23 44.08,77.23 ; 47.95,75.18 47.95,59.9 55,52.85 ; R30.1 35.43,68.58 44.08,77.23 ; 49.24,27.94 49.24,25.66 45.87,22.29 v1(45.53,22.29) ; 49.24,27.94 49.24,47.09 55,52.85 ; 21.84,66.17 21.84,66.98 v1(21.42,67.41) ; 21.84,66.17 22.61,66.17 ; 21.84,66.17 21.84,59.38 21.16,59.38 20.94,59.16 20.94,57.88 21.93,56.9 23.3,56.9 23.3,54.95 22.9,54.54 ; 85.6,23.89 v1(85.6,25.42) ; 67.95,49.61 67.95,49.6 65.47,49.6 64.54,50.53 56.26,50.53 56.26,51.59 55,52.85 ; 67.95,49.61 v1(75.58,49.61) 76.86,49.61 78.2,48.26 79.26,48.26 ; 67.95,49.61 LED11.1 ; 86.9,77.98 84.57,80.31 U15.16 U15.15 80.14,78.98 v1(78.08,76.93) ; 86.9,77.98 87.43,77.98 88.21,78.76 94.95,78.76 95.73,77.98 LED9.1 ; 86.9,77.98 LED8.1 ; 44.66,14.22 45.28,14.85 45.28,20.12 ; 44.66,14.22 45.75,13.13 45.85,13.13 L1.1 52.45,11.64 61.42,2.67 R33.1 62.11,1.95 62.24,1.82 62.24,0.89 61.55,0.89 61.4,0.74 v1(61.35,0.74) ; R41.3 14.55,28.5 14.89,28.16 15.88,28.16 15.88,29.1 16.58,29.1 17.49,30.01 17.49,41.21 R31.3 ; 22.9,54.54 22.48,54.54 R38.1 ; v1(25.37,61.47) 26.46,61.47 U2.16 ; v1(95.01,26.51) 95.06,26.51 95.22,26.67 LED17.1 97.34,26.67 97.34,27.01 v1(97.63,27.31) ; U13.15 U13.16 ; U13.16 82.03,51.86 v1(82.03,50.33) ; U13.16 96.26,51.99 97.68,50.57 97.68,48.08 96.9,47.3 96.9,46.24 ; 77.34,2.59 v1(77.34,0.74) ; 77.34,2.59 U11.16 82.29,2.59 ; 77.34,2.59 U11.15 ; 65.54,76.71 64.39,76.71 v1(64.29,76.81) ; 82.29,2.59 83.35,1.52 U4.16 ; 82.29,2.59 82.29,5.21 ; 1.35,74.7 1.35,98.57 4.94,102.15 4.94,105.81 U1.2
  Bottom Layer w0.254: C15.1 37.82,22.58 U5.1a ; v1(78.08,76.93) 64.4,76.93 v1(64.29,76.81) v1(53.61,76.81) ; R32.3 24.22,28.5 R41.3 ; v1(61.35,0.74) v1(77.34,0.74) ; v1(75.58,49.61) 76.3,50.33 v1(82.03,50.33) ; 1.35,74.7 2.43,74.7 9.71,67.41 v1(21.42,67.41) 21.42,65.42 v1(25.37,61.47) ; 45.28,20.12 45.28,22.04 v1(45.53,22.29) ; v1(95.01,26.51) 86.69,26.51 v1(85.6,25.42) 84.85,26.16 v1(81.92,26.16) ; v1(97.63,27.31) 93.91,31.04 v1(70.37,31.04)
(no net): length 136.6
  Top Layer w0.28: 70.87,93.22 71.38,93.22 R8.2 ; R15.2 92.83,18.54 94.61,18.54 ; 69.21,65.41 69.73,64.89 R12.2 ; 83.31,66.93 85.46,64.78 R13.2 ; R17.2 66.67,16.64 66.55,16.64 ; R9.2 85.97,91.96 84.58,93.34 ; R10.2 99.19,92.46 99.19,93.98 ; R20.2 69.98,34.93 69.98,37.08 ; R18.2 57.01,14.99 56.64,14.99 53.98,17.65 ; R14.2 93.59,63.11 95.76,65.28 ; R11.2 55.89,65.15 55.88,65.15 ; R21.2 80.64,36.71 80.64,38.73 ; R16.2 83.06,17.92 83.06,18.92 ; 58.8,90.3 61.86,90.3 R5.2 ; 92.33,38.73 92.33,36.08 R22.2 ; 56.52,37.85 59.06,37.85 R19.2
ADC1: length 57.9
  Top Layer w0.254: 8.22,83.22 8.22,82.18 3.69,77.65 3.69,38.04 6.86,34.87 R41.2
ADC2: length 46.5
  Top Layer w0.254: v1(15.56,74.75) 15.56,41.78 R31.2 ; 9.72,83.22 v1(9.72,77.11)
  Bottom Layer w0.254: v1(9.72,77.11) 12.08,74.75 v1(15.56,74.75)
ADC3: length 63.5
  Top Layer w0.254: 11.22,83.22 v1(11.22,78.81) ; v1(16.27,75.48) 16.27,45.44 24.13,37.58 R32.2
  Bottom Layer w0.254: v1(16.27,75.48) 12.94,78.81 v1(11.22,78.81)
CLK: length 52
  Top Layer w0.254: U2.2 32.16,62.99 31.15,64 v1(31.15,64.7) 31.15,73.95 25,80.1 25,87.81 U1.29 ; U7.2 32.26,52.32 31.05,53.53 v1(31.05,57.76)
  Bottom Layer w0.254: v1(31.05,57.76) 30.75,57.76 25.29,63.21 25.29,63.51 25.02,63.78 25.02,65.12 25.52,65.62 26.44,65.62 27.37,64.7 v1(31.15,64.7)
D+: length 11.7
  Top Layer w0.254: 99.84,6.59 99.84,5.59 98.98,5.59 ; 99.84,6.59 100.07,6.81 v1(100.07,7.17) ; 99.84,6.59 98.98,6.59 ; U4.5 93.62,7.17 v1(93.08,7.17)
  Bottom Layer w0.254: v1(100.07,7.17) v1(93.08,7.17)
D-: length 19.1
  Top Layer w0.254: 98.13,5.09 98.13,6.09 98.98,6.09 ; 98.13,5.09 98.13,4.26 v1(97.24,3.38) ; 98.13,5.09 98.98,5.09 ; v1(95.61,5.57) 95.61,6.66 94.39,7.87 U4.6
  Bottom Layer w0.254: v1(95.61,5.57) 99.1,5.57 100.9,3.77 100.9,2.81 100.42,2.32 98.3,2.32 v1(97.24,3.38)
DTR: length 166.7
  Top Layer w0.254: U4.13 89.59,5.33 v1(90.96,6.71) ; 34.18,96.52 32.56,96.52 ; 32.56,96.52 31.79,97.29 31.79,99 Q1.2 ; 32.56,96.52 32.56,84.19 v1(33.22,83.52) ; v1(44.84,76.05) 47.26,73.63 v1(47.26,24.66)
  Bottom Layer w0.254: v1(33.22,83.52) 40.69,76.05 v1(44.84,76.05) ; v1(47.26,24.66) 99.61,24.66 101.38,22.89 101.38,12.68 100.34,11.64 95.89,11.64 v1(90.96,6.71)
EN: length 36.1
  Top Layer w0.254: Q2.3 41.58,99.57 ; 41.58,99.57 38.07,103.08 29.16,103.08 28.94,102.87 27.58,102.87 27.58,103.55 27.42,103.71 26.03,103.71 ; 41.58,99.57 42.04,99.57 42.29,99.31 43.19,99.31 ; 26.03,103.71 26.03,92.66 26.35,92.35 SW2.2 ; 26.03,103.71 26.03,104.78 25,105.81 U1.41
IO0: length 45
  Top Layer w0.254: SW1.2 34.86,87.9 33.12,89.64 33.12,93.6 35.03,95.5 35.03,99.21 34.29,99.95 Q1.3 v1(32.27,99.95) ; U1.3 12.47,104.31 v1(14.21,102.58)
  Bottom Layer w0.254: v1(14.21,102.58) 29.64,102.58 v1(32.27,99.95)
IO8: length 42.8
  Top Layer w0.254: v1(4.75,92.26) 4.89,92.26 4.94,92.31 5.97,92.31 ; v1(4.92,67.42) 13.46,75.96 v1(13.46,92.26)
  Bottom Layer w0.254: v1(4.92,67.42) 2.73,69.62 1.35,69.62 ; v1(4.75,92.26) v1(13.46,92.26)
IO9: length 26.4
  Top Layer w0.254: 1.35,67.08 2.49,68.22 2.49,88.62 4.69,90.81 U1.12
IO10: length 28.4
  Top Layer w0.254: 1.35,64.54 2.95,66.13 2.95,88.4 4.44,89.89 5.39,89.89 U1.13
LD: length 42.7
  Top Layer w0.254: 30.35,61.81 28.73,63.43 28.73,71.6 22.94,77.4 22.94,86.31 U1.28 ; 30.35,61.81 30.18,61.64 30.18,60.81 30.38,60.61 30.38,52.91 32.24,51.05 U7.1 ; 30.35,61.81 32.37,61.81 U2.1
OUT: length 29.8
  Top Layer w0.254: U1.27 23.97,78.61 30.55,72.02 30.55,62.45 v1(30.57,62.44) ; U7.7 32.25,58.67 30.9,60.02 v1(30.9,61.22)
  Bottom Layer w0.254: v1(30.9,61.22) 30.9,62.1 v1(30.57,62.44)
RTS: length 178.2
  Top Layer w0.254: Q2.2 39.54,98.62 39.54,100.99 38.54,101.98 36.18,101.98 ; v1(22.23,50.8) 22.61,50.42 v1(22.61,47.5)
  Top Layer w0.28: v1(18.42,30.73) 18.42,27.56 v1(17.78,26.92) ; U4.14 88.01,4.06 85.73,6.35 v1(78.74,6.35) ; Q2.2 38.63,97.81 v1(38.61,97.79) ; v1(21.34,31.37) v1(21.34,39.37) ; v1(18.67,69.6) 18.67,66.8 v1(18.03,66.17) ; v1(27.81,80.52) 27.69,80.64 v1(27.69,83.57) ; v1(44.32,8.76) 51.99,8.76 v1(53.09,7.67) ; v1(21.84,78.49) 21.84,73.53 v1(22.1,73.28)
  Bottom Layer w0.28: v1(27.69,83.57) 27.69,86.87 v1(38.61,97.79) ; v1(22.23,50.8) 18.03,54.99 v1(18.03,66.17) ; v1(44.32,8.76) 39.12,13.97 36.58,13.97 36.2,14.35 25.02,14.35 17.78,21.59 v1(17.78,26.92) ; v1(18.42,30.73) 20.7,30.73 v1(21.34,31.37) ; 53.21,7.49 77.6,7.49 v1(78.74,6.35) ; v1(18.67,69.6) 18.67,69.85 v1(22.1,73.28) ; v1(21.34,39.37) 22.61,40.64 v1(22.61,47.5) ; v1(21.84,78.49) 25.78,78.49 v1(27.81,80.52)
RX: length 197.4
  Top Layer w0.28: v1(92.84,2.16) 93.55,2.16 U4.2 ; v1(5.84,26.03) 5.84,27.43 5.59,27.69 5.59,34.54 2.03,38.1 v1(2.03,61.72) ; U1.38 24.06,101.22 v1(25.4,101.22) ; v1(11.68,70.1) 11.68,69.72 v1(6.86,64.9)
  Bottom Layer w0.28: v1(25.4,101.22) 23.37,101.22 5.84,83.69 5.84,77.85 11.68,72.01 v1(11.68,70.1) ; v1(2.03,61.72) 5.21,64.9 v1(6.86,64.9) ; v1(92.84,2.16) 92.2,1.52 65.28,1.52 65.02,1.27 64.64,1.27 64.53,1.16 61.83,1.16 61.6,1.4 25.15,1.4 5.84,20.7 v1(5.84,26.03)
TX: length 168.7
  Top Layer w0.254: v1(20.53,80.27) 20.53,54.33 25.38,49.48 v1(25.38,20.56) ; U1.37 25,99.81 25,89.66 v1(25.21,89.46) ; v1(92.03,4.74) 92.71,4.06 U4.3
  Bottom Layer w0.254: v1(25.38,20.56) 34.64,20.56 39.59,15.61 43.65,15.61 48.34,10.92 54.96,10.92 55.08,11.04 85.73,11.04 v1(92.03,4.74) ; v1(20.53,80.27) 19,80.27 14.98,84.29 14.98,84.54 19.9,89.46 v1(25.21,89.46)
U+: length 98.3
  Top Layer w0.254: v1(100.04,101.57) 99.84,101.77 99.84,102.88 ; 99.84,102.88 99.84,103.87 98.98,103.87 ; 99.84,102.88 98.98,102.88 ; 17.22,83.22 17.22,84.25 20.78,84.25 20.95,84.08 v1(20.95,82.02)
  Bottom Layer w0.254: v1(100.04,101.57) 97.52,101.57 97.35,101.74 50.04,101.74 30.33,82.02 v1(20.95,82.02)
U-: length 93.8
  Top Layer w0.254: v1(15.72,84.45) 15.72,83.22 ; 98.07,102.43 v1(97.94,102.3) ; 98.07,102.43 98.13,102.37 98.98,102.37 ; 98.07,102.43 98.07,102.7 98.13,102.75 98.13,103.37 98.98,103.37
  Bottom Layer w0.254: v1(97.94,102.3) 41.1,102.3 23.25,84.45 v1(15.72,84.45)
$1N3: length 2.8
  Top Layer w0.254: 96.77,5.09 96.66,4.98 95.36,4.98 95.01,5.33 U4.4
$1N11: length 16.9
  Top Layer w0.254: 78.24,100.97 79.3,100.97 80.3,101.96 92.39,101.96 93.29,102.87 94.35,102.87
$1N12: length 17.8
  Top Layer w0.254: 51.96,101.35 53.01,101.35 53.79,102.13 60.56,102.13 60.62,102.06 66.66,102.06 67.47,102.87 LED3.4
$1N29: length 70.6
  Top Layer w0.254: v1(89.82,101.13) 89.97,101.13 90.02,101.09 91.07,101.09 ; v1(48.46,96.78) 48.46,82.83 55.83,75.46 55.83,75.18 56.88,75.18
  Bottom Layer w0.254: v1(89.82,101.13) 51.95,101.13 48.46,97.64 v1(48.46,96.78)
$1N30: length 26
  Top Layer w0.254: LED7.2 66.6,74.93 67.38,74.15 76.71,74.15 79.76,77.2 87.78,77.2 88.56,77.98 LED8.4
$1N31: length 17.2
  Top Layer w0.254: LED6.2 54.66,73.41 55.44,74.19 57.58,74.19 60.88,77.49 66.98,77.49 67.76,76.71 68.82,76.71
$1N32: length 14.4
  Top Layer w0.254: LED9.4 99.01,77.98 98.01,76.98 88.21,76.98 87.43,76.2 86.37,76.2
$1N33: length 69.4
  Top Layer w0.254: 96.79,76.2 97.91,76.2 v1(98.2,75.91) ; v1(57.4,47.06) 57.21,47.26 56.26,47.26
  Bottom Layer w0.254: v1(98.2,75.91) 101.57,72.55 101.57,60.34 88.29,47.06 v1(57.4,47.06)
$1N34: length 16.9
  Top Layer w0.254: LED11.4 67.95,46.33 65.53,46.33 62.38,49.48 54.48,49.48 54.48,50.53
$1N35: length 21.9
  Top Layer w0.254: 66.17,50.66 66.17,51.72 68.59,54.14 75.2,54.14 76.45,52.89 76.45,51.06 78.47,49.04 80.7,49.04 81.48,48.26 82.54,48.26
$1N36: length 20.2
  Top Layer w0.254: LED12.2 80.32,46.48 81.11,45.69 94.13,45.69 96.9,48.46 96.9,49.52
$1N46: length 16.4
  Top Layer w0.254: 81.52,102.74 79.92,102.74 79.05,101.87 67.64,101.87 66.86,101.09 65.8,101.09
$1N47: length 55.6
  Top Layer w0.254: U1.10 4.88,93.81 v1(4.75,93.94) ; 55.23,103.12 54.04,103.12 v1(54,103.16)
  Bottom Layer w0.254: v1(4.75,93.94) 13.97,103.16 v1(54,103.16)
$1N48: length 68.4
  Top Layer w0.254: LED14.4 56.67,27.94 v1(56.67,31.52) ; v1(102.87,31.67) 102.87,43.07 100.75,45.18 98.68,45.18 98.68,46.24
  Bottom Layer w0.254: v1(56.67,31.52) 56.81,31.67 v1(102.87,31.67)
$1N49: length 15.5
  Top Layer w0.254: 66.66,27.43 65.61,27.43 64.78,28.26 59.51,28.26 58.19,26.94 54.17,26.94 53.39,26.16 LED14.2
$1N50: length 25.6
  Top Layer w0.28: v1(68.71,22.35) 66.69,22.35 LED15.2 ; LED16.4 85.33,27.16 v1(82.04,23.88)
  Bottom Layer w0.28: v1(82.04,23.88) 80.52,22.35 v1(68.71,22.35)
$1N51: length 14
  Top Layer w0.254: LED17.4 98.5,26.67 97.72,25.89 88.32,25.89 87.38,24.95 87.38,23.89
$1N61: length 4.7
  Top Layer w0.254: 5.97,95.31 4.94,95.31 2.86,93.23 2.86,92.46
$1N66: length 91.6
  Top Layer w0.254: v1(28.1,65.67) 28.1,66.97 27,68.07 ; 27,68.07 27.96,69.03 27.96,70.77 27.54,71.19 25.42,71.19 22.61,68.37 22.61,67.68 ; 27,68.07 U2.11 ; U8.13 76.2,25.07 v1(76.2,25.46) ; v1(35.56,65.67) 39.12,62.11 v1(39.12,42.16)
  Bottom Layer w0.254: v1(35.56,65.67) v1(28.1,65.67) ; v1(76.2,25.46) 75.84,25.1 56.18,25.1 v1(39.12,42.16)
$1N67: length 86
  Top Layer w0.254: U2.12 26.53,66.8 24.51,64.78 v1(24.51,63.33) ; 77.34,22.22 77.34,22.91 76.95,22.91 75.57,24.29 U8.12 75.36,24.64 v1(75.36,25.84)
  Bottom Layer w0.254: v1(24.51,63.33) 25.96,61.87 25.96,61.06 23.95,59.06 23.76,59.06 21.15,56.45 21.15,55.87 26.14,50.88 31.91,50.88 56.95,25.84 v1(75.36,25.84)
$1N68: length 102
  Top Layer w0.254: v1(25.7,64.88) 26.34,65.53 U2.13 ; v1(70.99,23.74) 71.88,22.85 R27.2 ; v1(45.24,24.67) 45.24,66.11 v1(44.76,66.59) ; U8.11 v1(74.3,23.09)
  Bottom Layer w0.254: v1(44.76,66.59) 37.07,58.91 30.27,58.91 25.7,63.47 25.7,64.88 v1(25.7,64.88) ; v1(74.3,23.09) 73.64,23.74 v1(70.99,23.74) 46.17,23.74 v1(45.24,24.67)
$1N69: length 88.5
  Top Layer w0.254: 73.92,21.72 73.23,21.72 73.17,21.78 v1(73.17,23.02) 73.02,23.17 U8.10 ; v1(23.92,59.94) 23.92,61.72 26.46,64.26 U2.14
  Bottom Layer w0.254: v1(73.17,23.02) 46.22,23.02 45.16,24.07 44.83,24.07 37.56,31.34 37.56,44.45 33.17,48.84 27.44,48.84 20.68,55.61 20.68,56.7 v1(23.92,59.94)
$1N71: length 11
  Top Layer w0.254: 86.88,32.13 78.53,32.13 76.83,30.44 U8.4
$1N72: length 2.7
  Top Layer w0.254: U8.5 75.06,30.68 R21.1
$1N73: length 2.7
  Top Layer w0.254: U8.6 73.78,30.69 R20.1
$1N74: length 6.3
  Top Layer w0.254: U8.7 73.02,30.44 71.84,31.63 69.77,31.63 68.63,30.48 R19.1
$1N75: length 18.2
  Top Layer w0.254: v1(69.9,10.45) 69.9,8.79 U11.7 ; 84.59,11.81 84.59,11.09 84.32,10.83 v1(84.32,10.45)
  Bottom Layer w0.254: v1(69.9,10.45) v1(84.32,10.45)
$1N76: length 8.8
  Top Layer w0.254: 75.7,12.06 73.21,12.06 72.51,11.37 70.72,11.37 70.53,11.18 70.53,9.81 71.63,8.72 U11.6
$1N77: length 3.1
  Top Layer w0.254: U11.5 72.9,8.62 71.65,9.86 71.25,9.86 71.25,10.55
$1N78: length 16.8
  Top Layer w0.254: U11.4 74.17,8.06 73.18,7.07 62.74,7.07 59.94,9.86 59.94,10.55
$1N79: length 104.5
  Top Layer w0.254: v1(46.06,18.54) 46.06,14.16 46.98,13.24 53.85,13.24 63.12,3.97 v1(69.1,3.97) 70.36,2.71 U11.10 ; U2.6 34.01,68.07 34.72,67.36 35.87,67.36 43.52,59.71 43.52,24.59 v1(44.68,23.43) ; v1(80.78,4.29) 80.78,5.21
  Bottom Layer w0.254: v1(69.1,3.97) 70.23,5.1 79.97,5.1 v1(80.78,4.29) ; v1(44.68,23.43) 45.22,23.43 46.67,21.98 46.67,19.16 v1(46.06,18.54)
$1N81: length 90.3
  Top Layer w0.254: U11.11 71.63,2.81 69.88,4.56 63.46,4.56 54.21,13.81 47.23,13.81 46.84,14.2 46.84,20.44 45.58,21.7 45.29,21.7 42.16,24.82 42.16,29.81 39.99,31.98 39.99,62.06 35.5,66.56 R30.2 34.72,66.56 34.26,67.01 32.67,67.01 U2.5
$1N82: length 93.8
  Top Layer w0.254: U2.4 32.66,65.53 37.6,60.59 37.6,22.24 v1(36.86,21.5) ; v1(54.71,11.51) 62.93,3.29 62.93,2.67 R33.2 64.31,2.67 65.59,1.39 71.95,1.39 72.9,2.33 U11.12
  Bottom Layer w0.254: v1(36.86,21.5) 36.38,21.02 36.38,19.6 38.76,17.22 42.69,17.22 48.4,11.51 v1(54.71,11.51)
$1N85: length 98.5
  Top Layer w0.254: 64.31,0.89 63.75,0.89 ; 64.31,0.89 72.78,0.89 74.17,2.28 U11.13 ; 64.31,0.89 v1(64.31,1.83) ; v1(36.23,13.42) 36.23,45.78 37.16,46.72 37.16,59.92 32.82,64.26 U2.3
  Bottom Layer w0.254: v1(64.31,1.83) 47.82,1.83 v1(36.23,13.42)
$1N90: length 11.8
  Top Layer w0.254: U13.7 74.55,57.54 73.54,56.54 66.7,56.54 64.82,58.42 R11.1
$1N91: length 5.3
  Top Layer w0.254: R12.1 71.93,58.8 72.1,58.97 74.89,58.97 75.82,58.05 U13.6
$1N92: length 10.2
  Top Layer w0.254: R13.1 v1(83.95,57.56) ; U13.5 v1(77.09,56.3)
  Bottom Layer w0.254: v1(83.95,57.56) 82.7,56.3 v1(77.09,56.3)
$1N93: length 22.4
  Top Layer w0.254: R14.1 86.12,56.9 84.72,58.29 84.72,59.45 83.62,60.55 81.72,60.55 81.55,60.38 81.55,56.83 81.06,56.34 80.86,56.34 80.26,56.94 80.26,58.5 79.79,58.97 79.27,58.97 78.36,58.06 U13.4
$1N94: length 56.4
  Top Layer w0.254: 24.12,56.9 24.81,56.9 25.42,56.29 v1(25.42,55.43) 25.42,54.6 26.42,53.59 U7.14 ; U13.10 v1(74.55,53.55)
  Bottom Layer w0.254: v1(25.42,55.43) 27.25,53.6 74.5,53.6 v1(74.55,53.55)
$1N96: length 57.2
  Top Layer w0.254: v1(71.29,52.28) 72.83,50.75 74.82,50.75 75.82,51.75 U13.11 ; U7.13 27.07,54.86 28.05,53.88 v1(28.05,53) 25.91,53 25.01,53.91 25.01,54.23 24.95,54.3 24.26,54.3 24.26,54.98
  Bottom Layer w0.254: v1(71.29,52.28) 28.77,52.28 v1(28.05,53)
$1N97: length 59.9
  Top Layer w0.254: U13.12 v1(77.09,55.26) ; v1(27.74,55.5) 27.35,55.5 U7.12 26.26,56.13 23.84,58.55 21.84,58.55
  Bottom Layer w0.254: v1(77.09,55.26) 27.98,55.26 v1(27.74,55.5)
$1N100: length 63.9
  Top Layer w0.254: v1(21.78,56.2) 21.93,56.05 22.48,56.05 R38.2 ; U13.13 v1(78.36,54.14) ; v1(25.47,57.8) 25.87,57.4 U7.11
  Bottom Layer w0.254: v1(21.78,56.2) 24.92,56.2 25.47,56.76 ; 25.47,56.76 28.09,54.14 v1(78.36,54.14) ; 25.47,56.76 v1(25.47,57.8)
$1N102: length 7.5
  Top Layer w0.254: 67.56,86.11 68.24,86.11 69.48,87.34 72.86,87.34 73.79,86.41 U15.7
$1N103: length 4.2
  Top Layer w0.254: U15.6 75.06,87 76.39,88.34 76.39,89.03 R8.1
$1N104: length 13.7
  Top Layer w0.254: R9.1 85.15,88.39 v1(85.15,86.96) ; U15.5 76.33,85.4 v1(75.82,84.89)
  Bottom Layer w0.254: v1(75.82,84.89) 77.89,86.96 v1(85.15,86.96)
$1N105: length 17.5
  Top Layer w0.254: R10.1 85.68,85.6 81.78,89.51 78.92,89.51 77.6,88.18 U15.4
$1N106: length 53.4
  Top Layer w0.254: 34.17,58.81 32.77,57.4 U7.6 ; 34.17,58.81 v1(34.17,59.51) ; 34.17,58.81 34.37,58.61 35.43,58.61 R39.2 ; v1(72.48,78.68) 73.79,79.99 U15.10
  Bottom Layer w0.254: v1(34.17,59.51) 53.34,78.68 v1(72.48,78.68)
$1N108: length 55.7
  Top Layer w0.254: v1(67.2,76.32) 67.61,75.92 70.92,75.92 75.06,80.05 U15.11 ; v1(35.43,56.84) 35.43,55.75 34.72,55.75 34.72,55.77 34.04,56.44 32.77,56.44 U7.5
  Bottom Layer w0.254: v1(35.43,56.84) 36.02,56.84 46.07,66.89 46.07,69.24 53.01,76.17 67.06,76.17 v1(67.2,76.32)
$1N109: length 60.7
  Top Layer w0.254: v1(73.4,75.6) 76.33,78.53 U15.12 ; 35.43,52.44 35.43,53.13 35.09,53.13 33.22,55 ; 33.22,55 33.09,54.86 U7.4 ; 33.22,55 33.8,55.58 v1(33.8,55.85)
  Bottom Layer w0.254: v1(33.8,55.85) 35.65,55.85 47.7,67.9 47.7,70.25 53.05,75.6 v1(73.4,75.6)
$1N112: length 75.5
  Top Layer w0.254: U15.13 76.96,79.68 v1(76.96,79.28) ; v1(29.66,60.4) 29.66,52.29 32.66,49.28 33.41,49.28 ; 33.41,49.28 R43.2 ; 33.41,49.28 33.77,49.65 33.77,52.47 32.65,53.59 U7.3
  Bottom Layer w0.254: v1(29.66,60.4) 31.12,60.4 50.01,79.28 v1(76.96,79.28)
$1N114: length 16.3
  Top Layer w0.254: U7.10 26.38,59.01 23.92,59.01 23.32,59.61 23.32,67.44 26.49,70.61 U2.9
$1N2096: length 6
  Top Layer w0.254: 36.18,96.52 37.03,96.52 37.72,97.21 37.72,100.52 Q2.1
$1N2099: length 3.7
  Top Layer w0.254: Q1.1 32.25,100.9 33.33,101.98 34.18,101.98
$1N2166: length 5.7
  Top Layer w0.254: R4.2 16.24,31.56 15.88,31.2 15.88,30.26
$1N2213: length 8.7
  Top Layer w0.254: U8.3 78.11,30.37 79.09,31.36 81.47,31.36 82.79,30.05 82.79,28.62 82.73,28.56 82.04,28.56 C4.1
$1N2214: length 10.7
  Top Layer w0.254: U8.2 79.38,30.04 76.17,26.85 71.08,26.85 70.96,26.73 70.23,26.73
$1N2215: length 6.3
  Top Layer w0.254: U11.2 76.71,8.12 75.7,7.1 75.16,7.1 74.79,7.47 74.79,10.41 74.11,10.41
$1N2218: length 2.1
  Top Layer w0.254: U11.3 75.44,9.11 75.88,9.55 C5.1
$1N2223: length 2.1
  Top Layer w0.254: U13.2 80.9,59.02 80.83,59.08 U12.2
$1N2226: length 5.8
  Top Layer w0.254: C6.1 81.05,55.44 79.63,56.86 U13.3
$1N2231: length 3.3
  Top Layer w0.254: U14.2 79.95,88.77 80.14,88.58 U15.2
$1N2234: length 5.9
  Top Layer w0.254: U15.3 78.87,85.86 82.12,82.61 83.19,82.61
$1N5140: length 36.7
  Top Layer w0.254: 45.85,5.38 45.85,6.88 42.44,6.88 42.25,7.06 U16.2 37.68,7.06 33.91,10.84 33.91,32.44
$1N5379: length 13.3
  Top Layer w0.254: U2.15 26.86,62.99 28.73,61.11 28.73,52.77 28.29,52.32 U7.15
$1N5430: length 14
  Top Layer w0.254: 2.86,97.54 4.35,96.04 7,96.04 7,96.03 7,87.81 U1.14
$1N5439: length 10.6
  Top Layer w0.254: U1.15 4.94,86.31 4.75,86.49 v1(4.75,89.29)
  Bottom Layer w0.254: v1(4.75,89.29) 4.16,89.88 4.16,93.7 2.86,95
$1N5456: length 91
  Top Layer w0.254: v1(33.92,66.42) 38.02,62.33 38.02,20.36 37.78,20.12 ; v1(7,82.81) 7,84.81 U1.16
  Bottom Layer w0.254: U5.2b 41.36,18.7 39.2,18.7 37.78,20.12 ; v1(7,82.81) 14.55,82.81 30.94,66.42 v1(33.92,66.42)
$1N5500: length 42.7
  Top Layer w0.254: 12.72,83.22 12.72,79.03 4.25,70.57 4.25,45.79 HP1.1
$1N5779: length 34.7
  Top Layer w0.254: 18.72,83.22 18.72,81.97 14.87,78.12 14.87,61.29 8.25,54.66 HP3.1
$1N5793: length 51.6
  Top Layer w0.254: v1(17.05,47.13) 17.05,79.01 20.22,82.18 20.22,83.22 ; HP2.1 v1(6.04,47.44)
  Bottom Layer w0.254: v1(17.05,47.13) 16.3,46.38 7.09,46.38 v1(6.04,47.44)
$1N6036: length 75.2
  Top Layer w0.254: 14.22,83.22 14.22,67.3 4.67,57.75 4.67,53.38 6.61,51.44 7.36,51.44 8.11,50.7 8.11,16.68 7.19,15.76 7.19,14.22

## Copper pours and planes (outline as drawn; the poured copper is in the pictures)
GND on Top Layer: -21.03,131.75 -11.63,122.36 127.82,122.36 127.82,-2.87 122.74,-7.95 -22.55,-7.95
GND on Bottom Layer: -18.03,131.83 -8.64,122.43 130.81,122.43 130.81,-2.79 125.73,-7.87 -19.56,-7.87
(no net) on Top Layer: 91.38,21.41 99.63,21.41 99.63,15.93 91.38,15.93
(no net) on Top Layer: 65.85,96.84 74.1,96.84 74.1,91.37 65.85,91.37
(no net) on Top Layer: 64.33,69.67 72.58,69.67 72.58,64.19 64.33,64.19
(no net) on Top Layer: 51.69,95.26 59.94,95.26 59.94,89.79 51.69,89.79
(no net) on Top Layer: 79.69,96.97 87.95,96.97 87.95,91.5 79.69,91.5
(no net) on Top Layer: 60.13,20.64 68.39,20.64 68.39,15.17 60.13,15.17
(no net) on Top Layer: 48.96,21.41 57.21,21.41 57.21,15.93 48.96,15.93
(no net) on Top Layer: 92.01,41.98 100.27,41.98 100.27,36.51 92.01,36.51
(no net) on Top Layer: 77.28,41.6 85.53,41.6 85.53,36.12 77.28,36.12
(no net) on Top Layer: 80.07,68.78 88.33,68.78 88.33,63.3 80.07,63.3
(no net) on Top Layer: 50.48,42.49 58.74,42.49 58.74,37.01 50.48,37.01
(no net) on Top Layer: 51.12,68.4 59.37,68.4 59.37,62.92 51.12,62.92
(no net) on Top Layer: 80.2,21.41 88.46,21.41 88.46,15.93 80.2,15.93
(no net) on Top Layer: 64.33,42.61 72.58,42.61 72.58,37.14 64.33,37.14
(no net) on Top Layer: 93.66,96.72 101.92,96.72 101.92,91.24 93.66,91.24
(no net) on Top Layer: 92.27,68.52 100.52,68.52 100.52,63.05 92.27,63.05

Small or netless copper shapes (teardrops, artwork), in the pictures only: 582 on Top Layer, 162 on Bottom Layer

## Text on the board
Top Silkscreen Layer: g | 1 | 5 | 9 | 6 | 2 | 7 | 3 | 8 | 4 | a2|y | vcc | a1|x | i6 | a1 | i9 | i10 | i11 | i8 | a2 | a3 | i0 | 13 | 14 | 10 | 11 | 15 | 12 | 16 | i21 | i17 | i26 | en | uva
